# EAGLE design Data_Recovery_System (EAGLE 9.2.2)

## Sheet 1 of 4
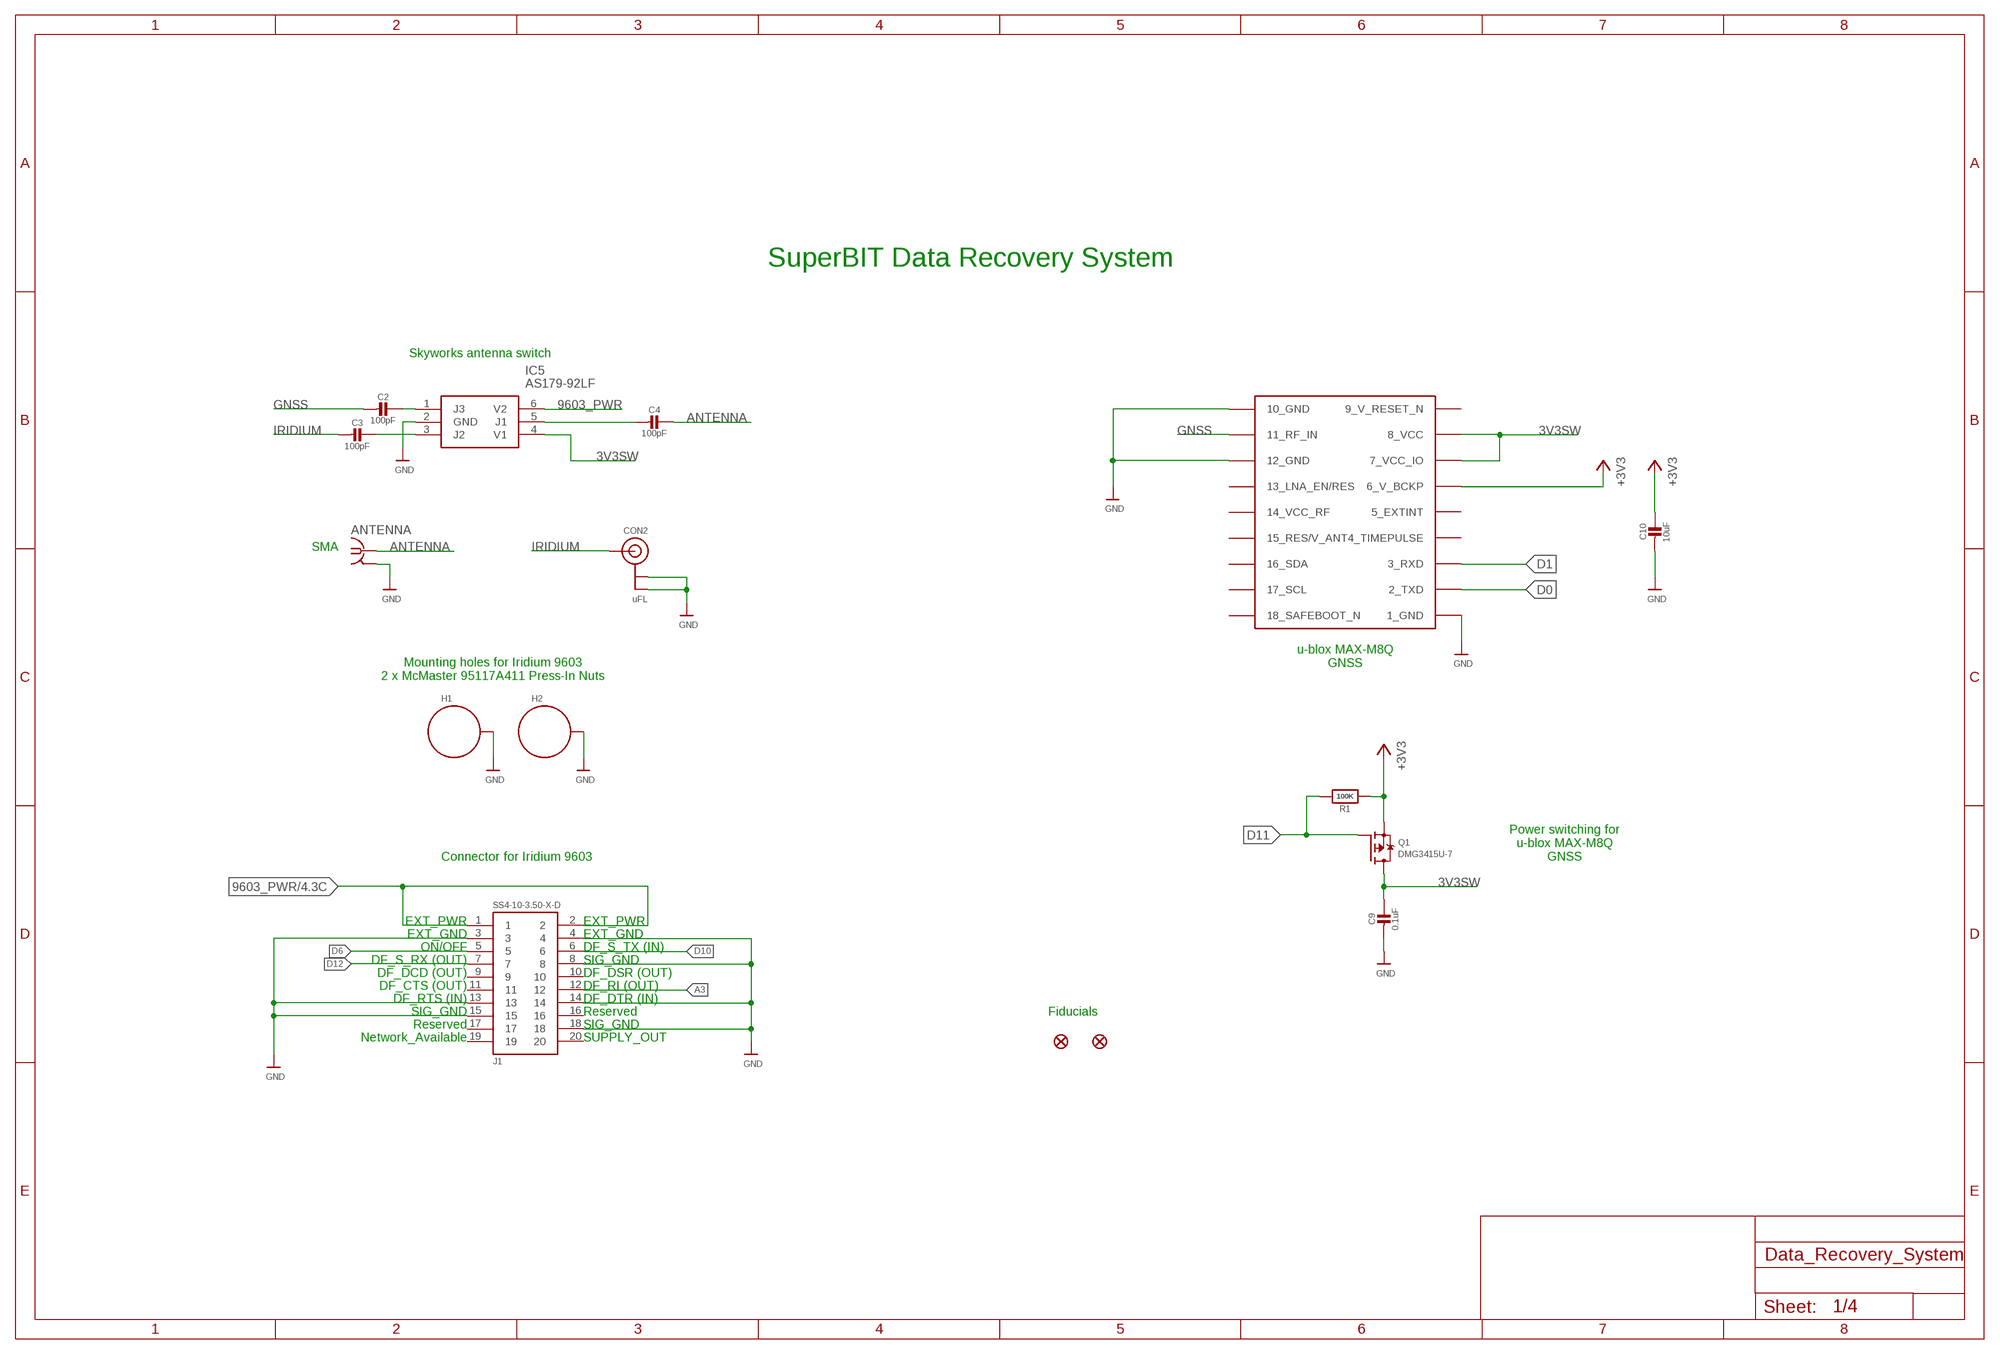
[diagram p0: schematic, sheet 1]

### Parts
ANTENNA  SMA-142-0711-821/826  [J502-ND-142-0711-821/826]
C2  100pF  CAP_CERAMIC0603_NO  [0603-NO@1]
C3  100pF  CAP_CERAMIC0603_NO  [0603-NO@1]
C4  100pF  CAP_CERAMIC0603_NO  [0603-NO@1]
C9  0.1uF  CAP_CERAMIC0805-NOOUTLINE  [0805-NO@1]
C10  10uF  CAP_CERAMIC0805-NOOUTLINE  [0805-NO@1]
CON2  uFL  ANTENNA_U.FL  [U.FL]
FD1  FIDUCIAL1X2  [FIDUCIAL-1X2]
FD2  FIDUCIAL1X2  [FIDUCIAL-1X2]
H1  STANDOFF_ELECTRICALMCMASTER-95117A411  [STANDOFF-ELECTRICAL-MCMASTER-95117A411]
H2  STANDOFF_ELECTRICALMCMASTER-95117A411  [STANDOFF-ELECTRICAL-MCMASTER-95117A411]
IC5  AS179-92LF  [SOT65P220X100-6N]
IC6  MAX-M8  [MAX-M8]
J1  SS4-10-3.50-X-D  [SS4-10-3.50-X-D]
Q1  DMG3415U-7  MOSFET-PWIDE  [SOT23-WIDE]
R1  100K  RESISTOR0805_NOOUTLINE  [0805-NO]

### Nets
3V3SW: C9.1 IC5.4(V1) IC6.7_VCC_IO IC6.8_VCC Q1.3(D)
9603_PWR: IC5.6(V2) J1.1 J1.2 ; also sheet 4
+3V3: C10.1 IC6.6_V_BCKP Q1.2(S) R1.1 ; also sheet 2,4
A3: J1.12 ; also sheet 2
ANTENNA: ANTENNA.1 C4.1
D0: IC6.2_TXD ; also sheet 2
D1: IC6.3_RXD ; also sheet 2
D6: J1.5 ; also sheet 2
D10: J1.6 ; also sheet 2
D11: Q1.1(G) R1.2 ; also sheet 2
D12: J1.7 ; also sheet 2
GND: ANTENNA.G@1 ANTENNA.G@2 ANTENNA.G@3 ANTENNA.G@4 C9.2 C10.2 CON2.1(GND) CON2.2(GND) H1.P1 H2.P1 IC5.2(GND) IC6.1_GND IC6.10_GND IC6.12_GND J1.3 J1.4 J1.8 J1.13 J1.14 J1.15 J1.18 ; also sheet 2,3,4
GNSS: C2.2 IC6.11_RF_IN
IRIDIUM: C3.2 CON2.3(SIGNAL)
N$4: C2.1 IC5.1(J3)
N$8: C3.1 IC5.3(J2)
N$9: C4.2 IC5.5(J1)
Unconnected: IC6.4_TIMEPULSE IC6.5_EXTINT IC6.13_LNA_EN(13_LNA_EN/RES) IC6.14_VCC_RF IC6.15_V_ANT/RESERVED(15_RES/V_ANT) IC6.16_SDA IC6.17_SCL IC6.18_SAFEBOOT_N J1.9 J1.10 J1.11 J1.16 J1.17 J1.19 J1.20

### Notes on the sheet
- SuperBIT Data Recovery System
- Skyworks antenna switch
- SMA
- u-blox MAX-M8Q
  GNSS
- Mounting holes for Iridium 9603
  2 x McMaster 95117A411 Press-In Nuts
- Connector for Iridium 9603
- Power switching for
  u-blox MAX-M8Q
  GNSS
- EXT_PWR | EXT_PWR
- EXT_GND | EXT_GND
- ON/OFF | DF_S_TX (IN)
- DF_S_RX (OUT) | SIG_GND
- DF_DCD (OUT) | DF_DSR (OUT)
- DF_CTS (OUT) | DF_RI (OUT)
- DF_RTS (IN) | DF_DTR (IN)
- SIG_GND | Reserved | Fiducials
- Reserved | SIG_GND
- Network_Available | SUPPLY_OUT

## Sheet 2 of 4
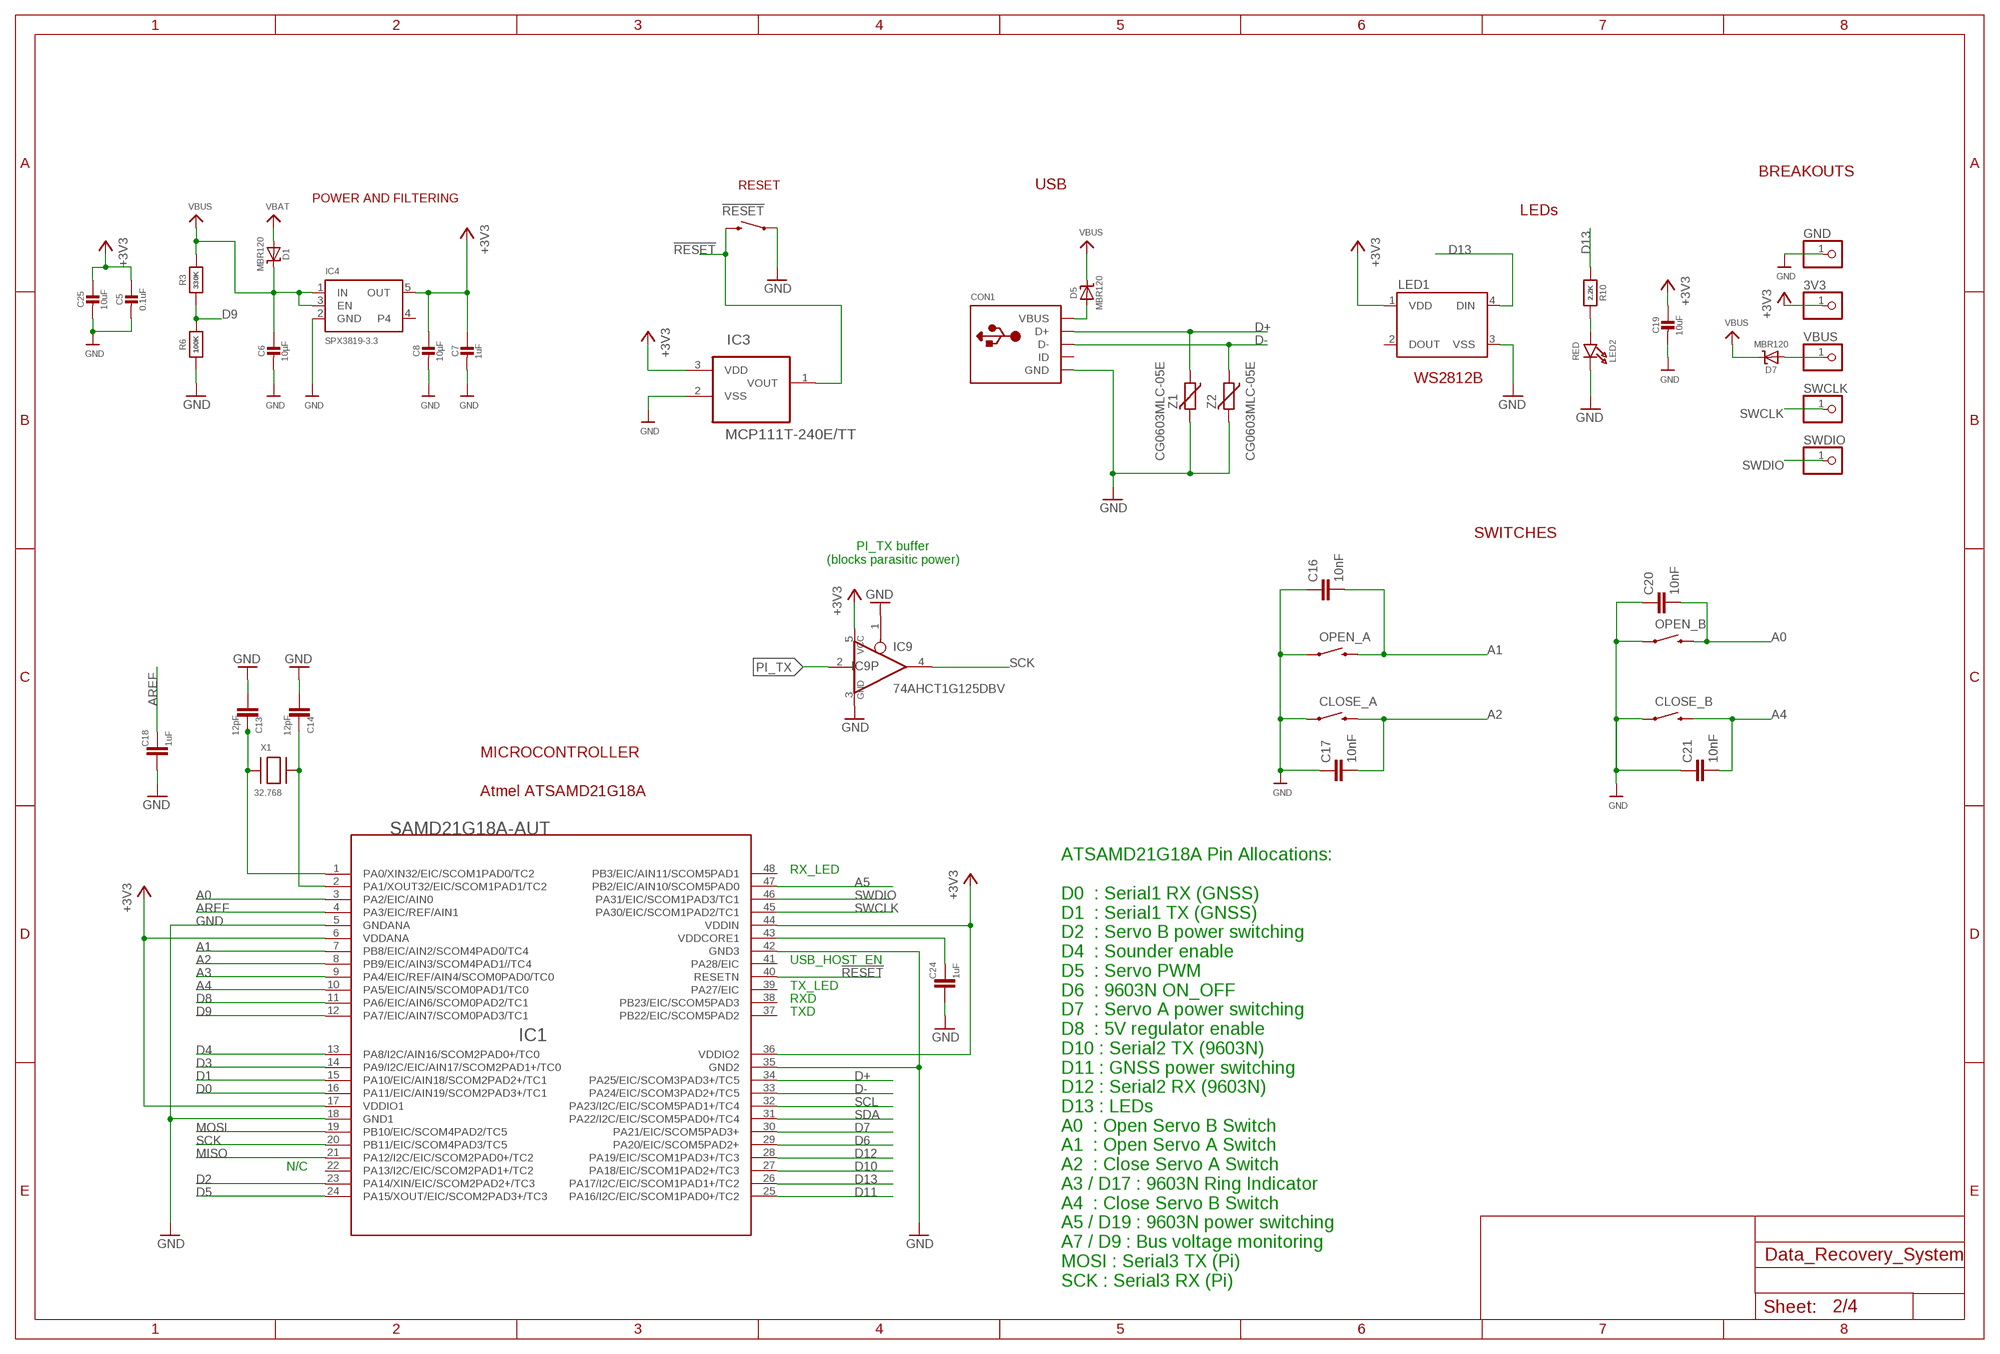
[diagram p1: schematic, sheet 2]

### Parts
3V3  PINHD-1X1  [1X01]
!RESET  SWITCH-MOMENTARY-2PTH  [TACTILE-PTH]
C5  0.1uF  CAP_CERAMIC0805-NOOUTLINE  [0805-NO@1]
C6  10µF  CAP_CERAMIC0805-NOOUTLINE  [0805-NO@1]
C7  1uF  CAP_CERAMIC0603_NO  [0603-NO@1]
C8  10µF  CAP_CERAMIC0805-NOOUTLINE  [0805-NO@1]
C13  12pF  C-EUC0603  [C0603]
C14  12pF  C-EUC0603  [C0603]
C16  10nF  C-EUC0805  [C0805]
C17  10nF  C-EUC0805  [C0805]
C18  1uF  C-EUC0603  [C0603]
C19  10uF  CAP_CERAMIC0805-NOOUTLINE  [0805-NO@1]
C20  10nF  C-EUC0805  [C0805]
C21  10nF  C-EUC0805  [C0805]
C24  1uF  C-EUC0603  [C0603]
C25  10uF  CAP_CERAMIC0805-NOOUTLINE  [0805-NO@1]
CLOSE_A  SWITCH-MOMENTARY-2PTH  [TACTILE-PTH]
CLOSE_B  SWITCH-MOMENTARY-2PTH  [TACTILE-PTH]
CON1  MICROBUILDER_USBFCI_10103594_CORRECTED  [MICROBUILDER_FCI_10103594_CORRECTED]
D1  MBR120  DIODE-SCHOTTKYSOD-123  [SOD-123]
D5  MBR120  DIODE-SCHOTTKYSOD-123  [SOD-123]
D7  MBR120  DIODE-SCHOTTKYSOD-123  [SOD-123]
GND  PINHD-1X1  [1X01]
IC1  SAMD21G18A-AUT  1792_SAMD21G18A-AUT  [TQFP48-7X7]
IC3  MCP111T-240E/TT  MCP111T-270E/TT  [SOT95P237X112-3N]
IC4  SPX3819-3.3  VREG_SOT23-5  [SOT23-5]
IC9  74AHCT1G125DBV  [SOT23-5]
LED1  WS2812B  [WS2812B]
LED2  RED  LED0805_NOOUTLINE  [CHIPLED_0805_NOOUTLINE]
OPEN_A  SWITCH-MOMENTARY-2PTH  [TACTILE-PTH]
OPEN_B  SWITCH-MOMENTARY-2PTH  [TACTILE-PTH]
R3  330K  RESISTOR0805_NOOUTLINE  [0805-NO]
R6  100K  RESISTOR0805_NOOUTLINE  [0805-NO]
R10  2.2K  RESISTOR_0603_NOOUT  [0603-NO]
SWCLK  PINHD-1X1  [1X01]
SWDIO  PINHD-1X1  [1X01]
VBUS  PINHD-1X1  [1X01]
X1  32.768  XTAL-3.2X1.5  [XTAL3215]
Z1  CG0603MLC-05E  0010_BRNCG0603MLC-05E  [CT/CN0603]
Z2  CG0603MLC-05E  0010_BRNCG0603MLC-05E  [CT/CN0603]

### Nets
!RESET: !RESET.3 IC1.40(RESETN) IC3.1(VOUT)
+3V3: 3V3.1 C5.1 C7.1 C8.1 C19.1 C25.1 IC1.6(VDDANA) IC1.17(VDDIO1) IC1.36(VDDIO2) IC1.44(VDDIN) IC3.3(VDD) IC4.5(OUT) IC9.5(VCC) LED1.1(VDD) ; also sheet 1,4
A0: C20.2 IC1.3(PA2/EIC/AIN0) OPEN_B.3
A1: C16.2 IC1.7(PB8/EIC/AIN2/SCOM4PAD0/TC4) OPEN_A.3
A2: C17.2 CLOSE_A.3 IC1.8(PB9/EIC/AIN3/SCOM4PAD1//TC4)
A3: IC1.9(PA4/EIC/REF/AIN4/SCOM0PAD0/TC0) ; also sheet 1
A4: C21.2 CLOSE_B.3 IC1.10(PA5/EIC/AIN5/SCOM0PAD1/TC0)
A5: IC1.47(PB2/EIC/AIN10/SCOM5PAD0) ; also sheet 4
AREF: C18.1 IC1.4(PA3/EIC/REF/AIN1)
D0: IC1.16(PA11/EIC/AIN19/SCOM2PAD3+/TC1) ; also sheet 1
D1: IC1.15(PA10/EIC/AIN18/SCOM2PAD2+/TC1) ; also sheet 1
D2: IC1.23(PA14/XIN/EIC/SCOM2PAD2+/TC3) ; also sheet 4
D3: IC1.14(PA9/I2C/EIC/AIN17/SCOM2PAD1+/TC0)
D4: IC1.13(PA8/I2C/AIN16/SCOM2PAD0+/TC0) ; also sheet 4
D5: IC1.24(PA15/XOUT/EIC/SCOM2PAD3+/TC3) ; also sheet 4
D6: IC1.29(PA20/EIC/SCOM5PAD2+) ; also sheet 1
D7: IC1.30(PA21/EIC/SCOM5PAD3+) ; also sheet 4
D8: IC1.11(PA6/EIC/AIN6/SCOM0PAD2/TC1) ; also sheet 4
D9: IC1.12(PA7/EIC/AIN7/SCOM0PAD3/TC1) R3.1 R6.2
D10: IC1.27(PA18/EIC/SCOM1PAD2+/TC3) ; also sheet 1
D11: IC1.25(PA16/I2C/EIC/SCOM1PAD0+/TC2) ; also sheet 1
D12: IC1.28(PA19/EIC/SCOM1PAD3+/TC3) ; also sheet 1
D13: IC1.26(PA17/I2C/EIC/SCOM1PAD1+/TC2) LED1.4(DIN) R10.1
D+: CON1.D+ IC1.34(PA25/EIC/SCOM3PAD3+/TC5) Z1.1
D-: CON1.D- IC1.33(PA24/EIC/SCOM3PAD2+/TC5) Z2.1
GND: !RESET.1 C5.2 C6.2 C7.2 C8.2 C13.2 C14.2 C16.1 C17.1 C18.2 C19.2 C20.1 C21.1 C24.2 C25.2 CLOSE_A.1 CLOSE_B.1 CON1.BASE@1(GND) CON1.BASE@2(GND) CON1.GND CON1.SPRT@1(GND) CON1.SPRT@2(GND) CON1.SPRT@3(GND) CON1.SPRT@4(GND) GND.1 IC1.5(GNDANA) IC1.18(GND1) IC1.35(GND2) IC1.42(GND3) IC3.2(VSS) IC4.2(GND) IC9.1(OE) IC9.3(GND) LED1.3(VSS) LED2.C OPEN_A.1 OPEN_B.1 R6.1 Z1.2 Z2.2 ; also sheet 1,3,4
MISO: IC1.21(PA12/I2C/EIC/SCOM2PAD0+/TC2)
MOSI: IC1.19(PB10/EIC/SCOM4PAD2/TC5) ; also sheet 3
N$1: C13.1 IC1.1(PA0/XIN32/EIC/SCOM1PAD0/TC2) X1.P$1
N$2: C14.1 IC1.2(PA1/XOUT32/EIC/SCOM1PAD1/TC2) X1.P$2
N$3: LED2.A R10.2
N$10: CON1.VBUS D5.A
N$23: D7.A VBUS.1
PI_TX: IC9.2(I) ; also sheet 3
SCK: IC1.20(PB11/EIC/SCOM4PAD3/TC5) IC9.4(O)
SCL: IC1.32(PA23/I2C/EIC/SCOM5PAD1+/TC4)
SDA: IC1.31(PA22/I2C/EIC/SCOM5PAD0+/TC4)
SWCLK: IC1.45(PA30/EIC/SCOM1PAD2/TC1) SWCLK.1
SWDIO: IC1.46(PA31/EIC/SCOM1PAD3/TC1) SWDIO.1
VBAT: D1.A ; also sheet 3,4
VBUS: C6.1 D1.C D5.C D7.C IC4.1(IN) IC4.3(EN) R3.2
VDDCORE2: C24.1 IC1.43(VDDCORE1)
Unconnected: CON1.ID IC1.22(PA13/I2C/EIC/SCOM2PAD1+/TC2) IC1.37(PB22/EIC/SCOM5PAD2) IC1.38(PB23/EIC/SCOM5PAD3) IC1.39(PA27/EIC) IC1.41(PA28/EIC) IC1.48(PB3/EIC/AIN11/SCOM5PAD1) IC4.4 LED1.2(DOUT)

### Notes on the sheet
- BREAKOUTS
- RESET | USB
- POWER AND FILTERING
- LEDs
- WS2812B
- SWITCHES
- PI_TX buffer
  (blocks parasitic power)
- MICROCONTROLLER
- Atmel ATSAMD21G18A
- ATSAMD21G18A Pin Allocations:
  
  D0  : Serial1 RX (GNSS)
  D1  : Serial1 TX (GNSS)
  D2  : Servo B power switching
  D4  : Sounder enable
  D5  : Servo PWM
  D6  : 9603N ON_OFF
  D7  : Servo A power switching
  D8  : 5V regulator enable
  D10 : Serial2 TX (9603N)
  D11 : GNSS power switching
  D12 : Serial2 RX (9603N)
  D13 : LEDs
  A0  : Open Servo B Switch
  A1  : Open Servo A Switch
  A2  : Close Servo A Switch
  A3 / D17 : 9603N Ring Indicator
  A4  : Close Servo B Switch
  A5 / D19 : 9603N power switching
  A7 / D9 : Bus voltage monitoring
  MOSI : Serial3 TX (Pi)
  SCK : Serial3 RX (Pi)
- RX_LED
- USB_HOST_EN
- TX_LED
- RXD
- TXD
- N/C

## Sheet 3 of 4
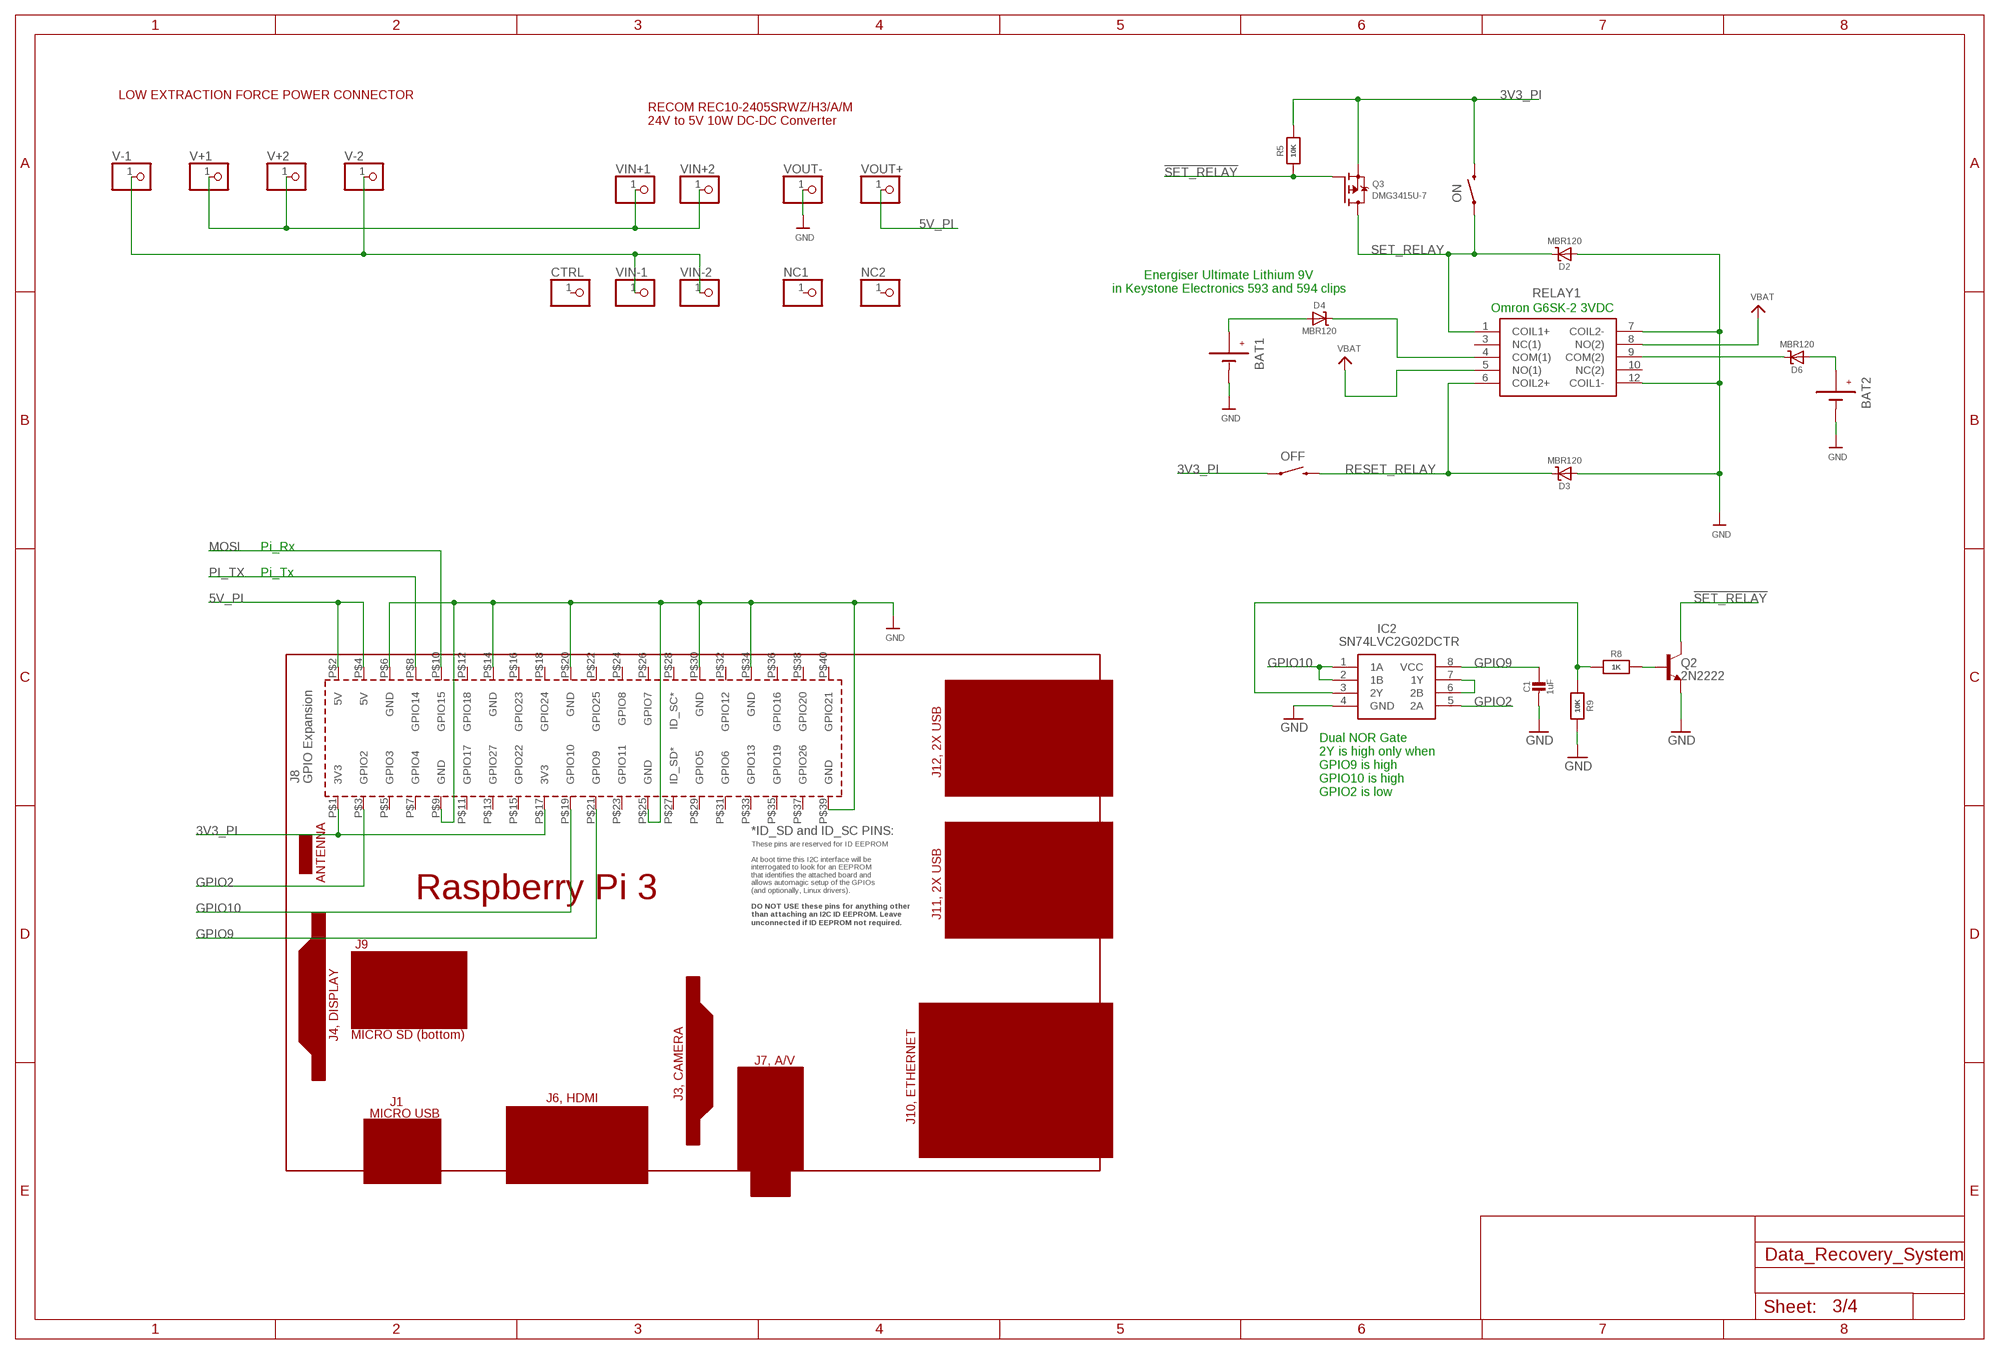
[diagram p2: schematic, sheet 3]

### Parts
BAT1  BATTERYBATTERY-9V-KEYSTONE-593-594  [BATTERY-9V-KEYSTONE-593-594]
BAT2  BATTERYBATTERY-9V-KEYSTONE-593-594  [BATTERY-9V-KEYSTONE-593-594]
C1  1uF  CAP_CERAMIC0603_NO  [0603-NO@1]
CTRL  PINHD-1X1  [1X01]
D2  MBR120  DIODE-SCHOTTKYSOD-123  [SOD-123]
D3  MBR120  DIODE-SCHOTTKYSOD-123  [SOD-123]
D4  MBR120  DIODE-SCHOTTKYSOD-123  [SOD-123]
D6  MBR120  DIODE-SCHOTTKYSOD-123  [SOD-123]
IC2  SN74LVC2G02DCTR  [SOP65P400X130-8N]
NC1  PINHD-1X1  [1X01]
NC2  PINHD-1X1  [1X01]
OFF  SWITCH-MOMENTARY-2PTH  [TACTILE-PTH]
ON  SWITCH-MOMENTARY-2PTH  [TACTILE-PTH]
PCB1  RPI3  [RPI3]
Q2  2N2222  MMBT2222ALT1-NPN-SOT23-BEC  [SOT23-BEC]
Q3  DMG3415U-7  MOSFET-PWIDE  [SOT23-WIDE]
R5  10K  RESISTOR0805_NOOUTLINE  [0805-NO]
R8  1K  RESISTOR_0603_NOOUT  [0603-NO]
R9  10K  RESISTOR_0603_NOOUT  [0603-NO]
RELAY1  G6SK-2_DC5  [G6SK2DC5]
V+1  PINHD-1X1  [1X01]
V+2  PINHD-1X1  [1X01]
V-1  PINHD-1X1  [1X01]
V-2  PINHD-1X1  [1X01]
VIN+1  PINHD-1X1  [1X01]
VIN+2  PINHD-1X1  [1X01]
VIN-1  PINHD-1X1  [1X01]
VIN-2  PINHD-1X1  [1X01]
VOUT+  PINHD-1X1  [1X01]
VOUT-  PINHD-1X1  [1X01]

### Nets
3V3_PI: OFF.1 ON.3 PCB1.P$1(3V3) PCB1.P$17(3V3) Q3.2(S) R5.2
5V_PI: PCB1.P$2(5V) PCB1.P$4(5V) VOUT+.1
!SET_RELAY: Q2.C Q3.1(G) R5.1
GND: BAT1.GND1(-) BAT1.GND2(-) BAT1.GND(-) BAT2.GND1(-) BAT2.GND2(-) BAT2.GND(-) C1.2 D2.A D3.A IC2.4(GND) PCB1.P$6(GND) PCB1.P$9(GND) PCB1.P$14(GND) PCB1.P$20(GND) PCB1.P$25(GND) PCB1.P$30(GND) PCB1.P$34(GND) PCB1.P$39(GND) Q2.E R9.2 RELAY1.7(COIL2-) RELAY1.12(COIL1-) VOUT-.1 ; also sheet 1,2,4
GPIO2: IC2.5(2A) PCB1.P$3(GPIO2)
GPIO9: C1.1 IC2.8(VCC) PCB1.P$21(GPIO9)
GPIO10: IC2.1(1A) IC2.2(1B) PCB1.P$19(GPIO10)
MOSI: PCB1.P$10(GPIO15) ; also sheet 2
N$5: V-1.1 V-2.1 VIN-1.1 VIN-2.1
N$7: D6.C RELAY1.9(COM(2))
N$11: BAT2.PWR1(+) BAT2.PWR2(+) BAT2.PWR(+) D6.A
N$12: BAT1.PWR1(+) BAT1.PWR2(+) BAT1.PWR(+) D4.A
N$13: D4.C RELAY1.4(COM(1))
N$14: Q2.B R8.2
N$16: IC2.3(2Y) R8.1 R9.1
N$21: IC2.6(2B) IC2.7(1Y)
PI_TX: PCB1.P$8(GPIO14) ; also sheet 2
RESET_RELAY: D3.C OFF.3 RELAY1.6(COIL2+)
SET_RELAY: D2.C ON.1 Q3.3(D) RELAY1.1(COIL1+)
V_EXT: V+1.1 V+2.1 VIN+1.1 VIN+2.1
VBAT: RELAY1.5(NO(1)) RELAY1.8(NO(2)) ; also sheet 2,4
Unconnected: CTRL.1 NC1.1 NC2.1 PCB1.P$5(GPIO3) PCB1.P$7(GPIO4) PCB1.P$11(GPIO17) PCB1.P$12(GPIO18) PCB1.P$13(GPIO27) PCB1.P$15(GPIO22) PCB1.P$16(GPIO23) PCB1.P$18(GPIO24) PCB1.P$22(GPIO25) PCB1.P$23(GPIO11) PCB1.P$24(GPIO8) PCB1.P$26(GPIO7) PCB1.P$27(ID_SD*) PCB1.P$28(ID_SC*) PCB1.P$29(GPIO5) PCB1.P$31(GPIO6) PCB1.P$32(GPIO12) PCB1.P$33(GPIO13) PCB1.P$35(GPIO19) PCB1.P$36(GPIO16) PCB1.P$37(GPIO26) PCB1.P$38(GPIO20) PCB1.P$40(GPIO21) RELAY1.3(NC(1)) RELAY1.10(NC(2))

### Notes on the sheet
- LOW EXTRACTION FORCE POWER CONNECTOR
- RECOM REC10-2405SRWZ/H3/A/M
  24V to 5V 10W DC-DC Converter
- Energiser Ultimate Lithium 9V
  in Keystone Electronics 593 and 594 clips
- Omron G6SK-2 3VDC
- Pi_Rx
- Pi_Tx
- Dual NOR Gate
  2Y is high only when
  GPIO9 is high
  GPIO10 is high
  GPIO2 is low

## Sheet 4 of 4
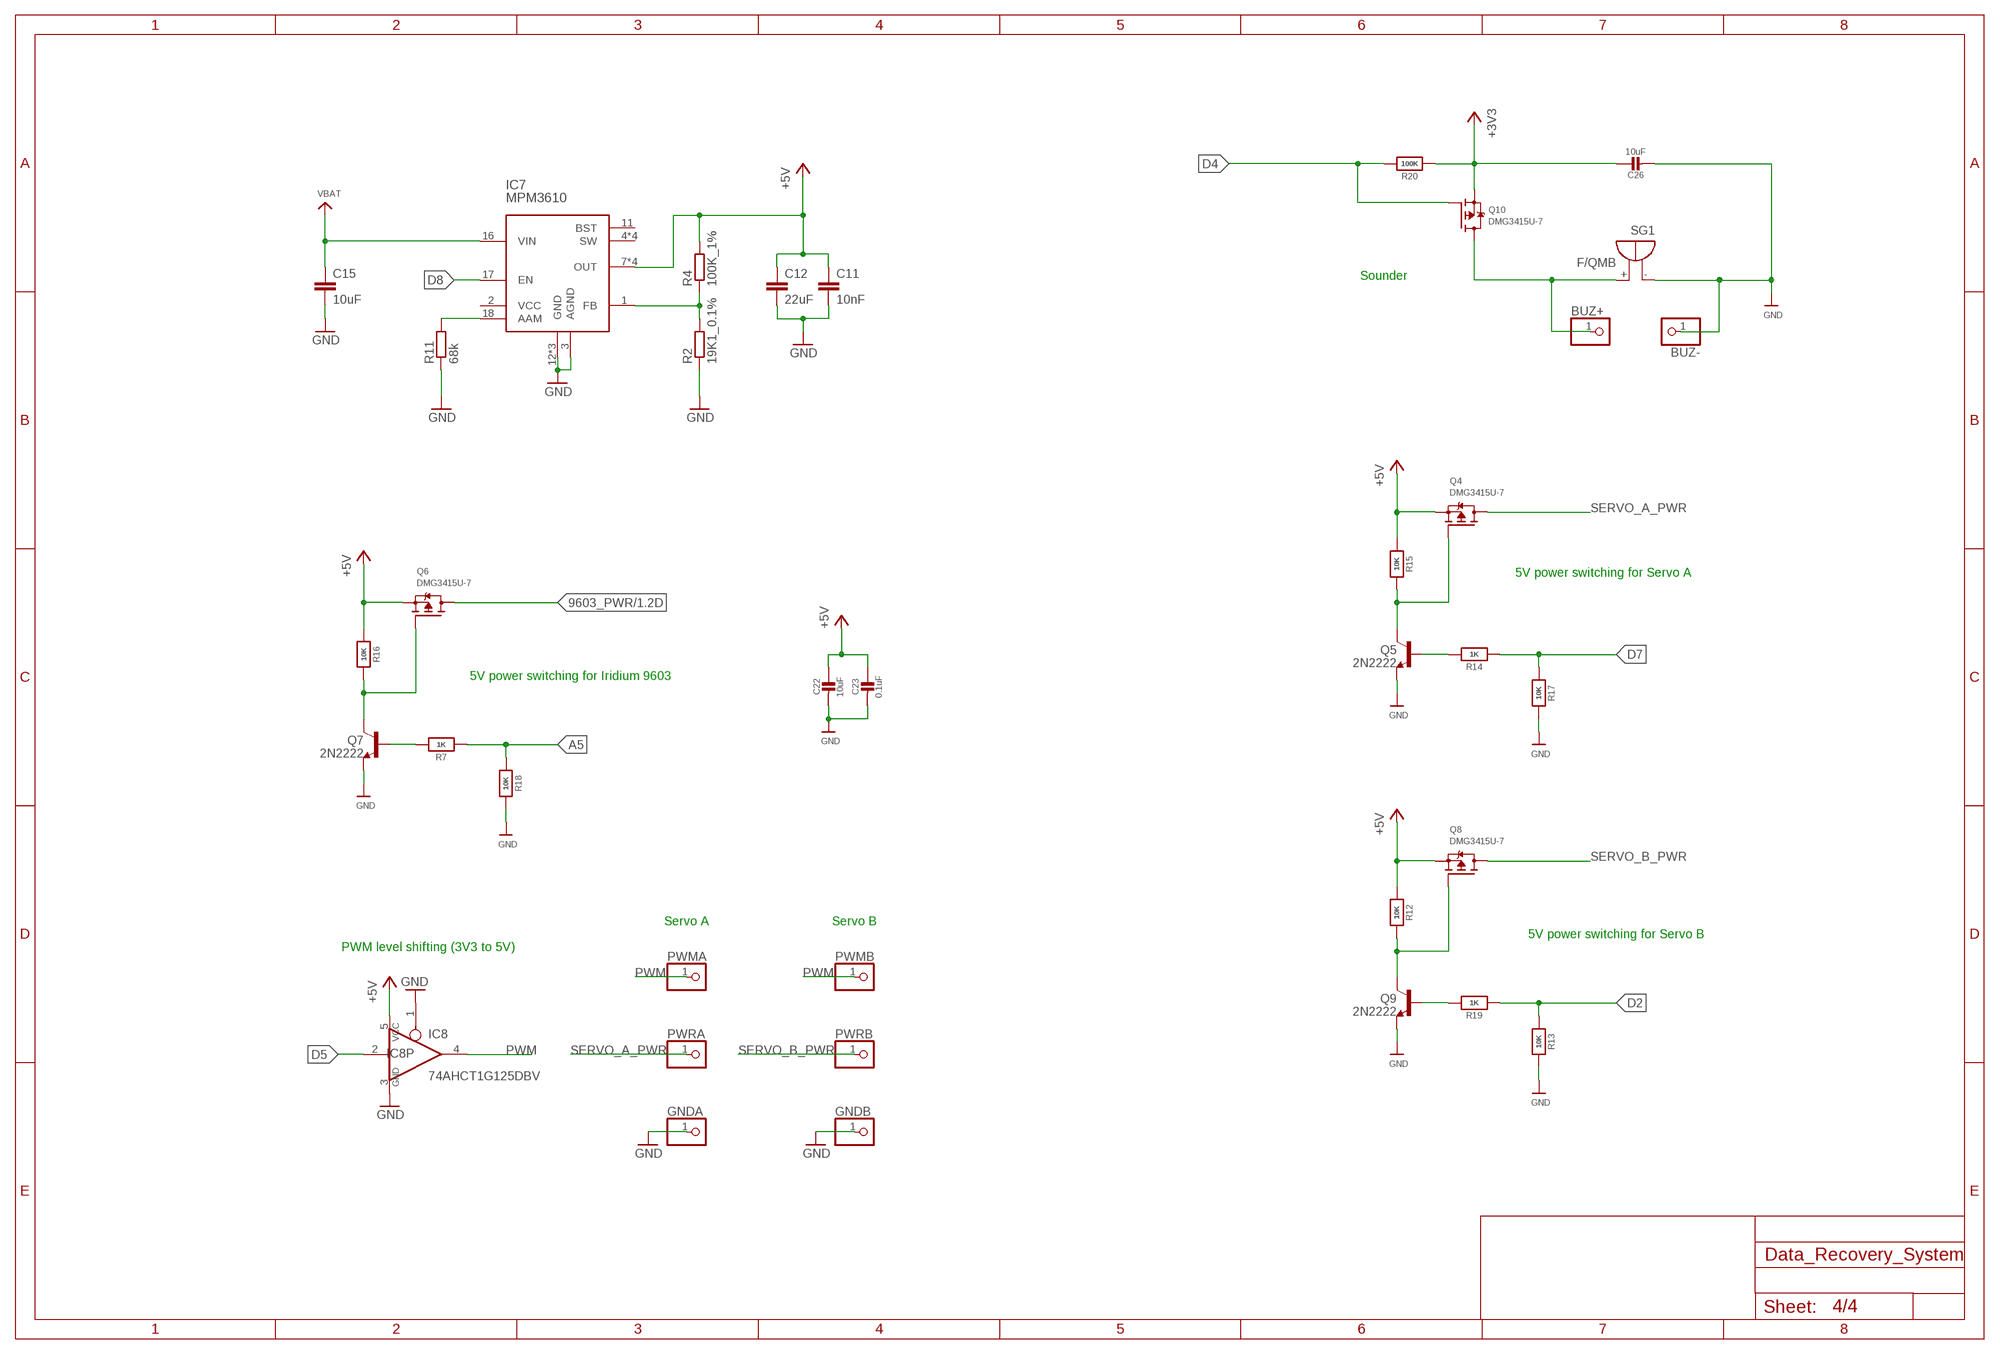
[diagram p3: schematic, sheet 4]

### Parts
BUZ+  PINHD-1X1  [1X01]
BUZ-  PINHD-1X1  [1X01]
C11  10nF  C-EUC0805  [C0805]
C12  22uF  C-EUC0805  [C0805]
C15  10uF  C-EUC0805  [C0805]
C22  10uF  CAP_CERAMIC0805-NOOUTLINE  [0805-NO@1]
C23  0.1uF  CAP_CERAMIC0805-NOOUTLINE  [0805-NO@1]
C26  10uF  CAP_CERAMIC0805-NOOUTLINE  [0805-NO@1]
GNDA  PINHD-1X1  [1X01]
GNDB  PINHD-1X1  [1X01]
IC7  MPM3610  2093_MPM3610GQV-P  [QFN-20]
IC8  74AHCT1G125DBV  [SOT23-5]
PWMA  PINHD-1X1  [1X01]
PWMB  PINHD-1X1  [1X01]
PWRA  PINHD-1X1  [1X01]
PWRB  PINHD-1X1  [1X01]
Q4  DMG3415U-7  MOSFET-PWIDE  [SOT23-WIDE]
Q5  2N2222  MMBT2222ALT1-NPN-SOT23-BEC  [SOT23-BEC]
Q6  DMG3415U-7  MOSFET-PWIDE  [SOT23-WIDE]
Q7  2N2222  MMBT2222ALT1-NPN-SOT23-BEC  [SOT23-BEC]
Q8  DMG3415U-7  MOSFET-PWIDE  [SOT23-WIDE]
Q9  2N2222  MMBT2222ALT1-NPN-SOT23-BEC  [SOT23-BEC]
Q10  DMG3415U-7  MOSFET-PWIDE  [SOT23-WIDE]
R2  19K1_0.1%  R-EU_R0805  [R0805]
R4  100K_1%  R-EU_R0805  [R0805]
R7  1K  RESISTOR_0603_NOOUT  [0603-NO]
R11  68k  R-EU_R0805  [R0805]
R12  10K  RESISTOR_0603_NOOUT  [0603-NO]
R13  10K  RESISTOR_0603_NOOUT  [0603-NO]
R14  1K  RESISTOR_0603_NOOUT  [0603-NO]
R15  10K  RESISTOR_0603_NOOUT  [0603-NO]
R16  10K  RESISTOR_0603_NOOUT  [0603-NO]
R17  10K  RESISTOR_0603_NOOUT  [0603-NO]
R18  10K  RESISTOR_0603_NOOUT  [0603-NO]
R19  1K  RESISTOR_0603_NOOUT  [0603-NO]
R20  100K  RESISTOR0805_NOOUTLINE  [0805-NO]
SG1  F/QMB  [F/QMB]

### Nets
9603_PWR: Q6.3(D) ; also sheet 1
+3V3: C26.1 Q10.2(S) R20.1 ; also sheet 1,2
+5V: C11.1 C12.1 C22.1 C23.1 IC7.7(OUT) IC7.8(OUT) IC7.9(OUT) IC7.20(OUT) IC8.5(VCC) Q4.2(S) Q6.2(S) Q8.2(S) R4.2 R12.1 R15.1 R16.1
A5: R7.1 R18.1 ; also sheet 2
D2: R13.1 R19.1 ; also sheet 2
D4: Q10.1(G) R20.2 ; also sheet 2
D5: IC8.2(I) ; also sheet 2
D7: R14.1 R17.1 ; also sheet 2
D8: IC7.17(EN) ; also sheet 2
GND: BUZ-.1 C11.2 C12.2 C15.2 C22.2 C23.2 C26.2 GNDA.1 GNDB.1 IC7.3(AGND) IC7.12(GND) IC7.13(GND) IC7.14(GND) IC8.1(OE) IC8.3(GND) Q5.E Q7.E Q9.E R2.1 R11.1 R13.2 R17.2 R18.2 SG1.-(+) ; also sheet 1,2,3
N$6: IC7.1(FB) R2.2 R4.1
N$15: Q7.B R7.2
N$17: Q6.1(G) Q7.C R16.2
N$18: Q9.B R19.2
N$19: Q4.1(G) Q5.C R15.2
N$20: Q5.B R14.2
N$22: Q8.1(G) Q9.C R12.2
N$24: BUZ+.1 Q10.3(D) SG1.+(-)
N$29: IC7.18(AAM) R11.2
PWM: IC8.4(O) PWMA.1 PWMB.1
SERVO_A_PWR: PWRA.1 Q4.3(D)
SERVO_B_PWR: PWRB.1 Q8.3(D)
VBAT: C15.1 IC7.16(VIN) ; also sheet 2,3
Unconnected: IC7.2(VCC) IC7.4(SW) IC7.5(SW) IC7.6(SW) IC7.11(BST) IC7.19(SW)

### Notes on the sheet
- Sounder
- 5V power switching for Servo A
- 5V power switching for Iridium 9603
- Servo A | Servo B
- 5V power switching for Servo B
- PWM level shifting (3V3 to 5V)

## Power pins joined to a net without a drawn wire
9_V_RESET_N: IC6.9_RESET_N(9_V_RESET_N)

## Library data of the parts
3V3 BUZ+ BUZ- CTRL GND GNDA GNDB NC1 NC2 PWMA PWMB PWRA PWRB SWCLK SWDIO V+1 V+2 V-1 V-2 VBUS VIN+1 VIN+2 VIN-1 VIN-2 VOUT+ VOUT- = adafruit:PINHD-1X1: Pin header 1x1 for 0.1" spacing With round pins
!RESET CLOSE_A CLOSE_B OFF ON OPEN_A OPEN_B = SparkFun-Electromechanical:SWITCH-MOMENTARY-2: Various NO switches- pushbuttons, reed, etc; PROD_ID: SWCH-08441
ANTENNA = con-coax:SMA-: SMA 50 Ohm End Launch Jack Receptacle - Round Contact Johnson Components Source: www.johnsoncomponents.com .. J502-ND.pdf; MF: JOHNSON COMPONENTS; MPN: 142-0711-821; OC_FARNELL: 1019328; OC_NEWARK: 16F3627
BAT1 BAT2 = SparkFun-Electromechanical:BATTERY: Battery Holders Various common sizes : AA, AAA, 18650 (PRT-12895), 20mm coin cell and 12mm coin cell. 20MM_4LEGS, BATT-10373
C1-C10 C19 C22 C23 C25 C26 = microbuilder:CAP_CERAMIC: Ceramic Capacitors For new designs, use the packages preceded by an '_' character since they are more reliable: The following footprints should be used on most boards: _0402 - Standard footprint for regular board layouts _0603 - Standard footprint for regular board layouts _0805 - Standard footprint for regular board layouts _1206 - Standard footprint for regular board layouts For extremely tight-pitch boards where space is at a premium, the following 'micro-pitch' footprints can be used (smaller pads, no silkscreen outline, etc.): _0402MP - Micro-pitch footprint for very dense/compact boards _0603MP - Micro-pitch footprint for very dense/compact boards _0805MP - Micro-pitch footprint for very dense/compact boards _1206MP - Micro-pitch footprint for very dense/compact boards
C11-C18 C20 C21 C24 = rcl:C-EU: CAPACITOR, European symbol; SPICEPREFIX: C
CON1 = Iridium_9603_Beacon:MICROBUILDER_USB: USB Connectors USBMINIB - Surface Mount Female Mini-B USB Connector 4UConnector: 06564
CON2 = microbuilder:ANTENNA_U.FL: U.FL Antenna Connector
D1-D7 = microbuilder:DIODE-SCHOTTKY
FD1 FD2 = SparkFun-Aesthetics:FIDUCIAL: Fiducial Alignment Points Various fiducial points for machine vision alignment.
H1 H2 = SparkFun-Electromechanical:STANDOFF_ELECTRICAL: A standoff intended to be an electrically connected point.
IC1 = IntegratedCircuits:1792_SAMD21G18A-AUT: Atmel D21 32bit ARM Cortex-M0 microcontroller - 48 PIN TQFP 256KB flash memory + 32KB SRAM
IC2 = SamacSys_Parts:SN74LVC2G02DCTR: DUAL 2-INPUT POSITIVE-NOR GATE Source: Datasheet <http://www.ti.com/lit/gpn/sn74lvc2g02>; ARROW_PART_NUMBER: SN74LVC2G02DCTR; ARROW_PRICE/STOCK: https://www.arrow.com/en/products/sn74lvc2g02dctr/texas-instruments; DESCRIPTION: DUAL 2-INPUT POSITIVE-NOR GATE; HEIGHT: mm; MANUFACTURER_NAME: Texas Instruments; MANUFACTURER_PART_NUMBER: SN74LVC2G02DCTR
IC3 = Microchip-MCP11:MCP11: Micropower Voltage Detector ,SOT23-3;; MPN: MCP111T-240E/TT; OC_FARNELL: 1851877; OC_NEWARK: 56J7328; PACKAGE: SOT23-3; SUPPLIER: MICROCHIP
IC4 = microbuilder:VREG_SOT23-5: SOT23-5 Fixed Voltage Regulators Part Current Out V Out V In V Dropout ?JA (°C/W) TJ (°C) Digikey Part No. ADP121 150mA 3.3V 3.4-5.5V 0.09V @ 150mA -- -- ADP121-AUJZ33R7CT-ND ADP121 150mA 3.0V 3.1-5.5V 0.09V @ 150mA -- -- ADP121-AUJZ30R7CT-ND ADP122 300mA 3.3V 3.4-5.5V 0.085V @ 300mA -- -- ADP122AUJZ-3.3-R7CT-ND ADP1712 300mA 3.3V 3.5-5.5V 0.17V @ 300mA -- -- ADP1712AUJZ-3.3-R7TR-ND AP7311 (Low Cost) 150mA 3.3V 3.5-6V 0.15V @ 150mA -- -- AP7311-33WG-7DICT-ND LD39015M18R 150mA 1.8V 1.9V-5.5V 0.08V @ 100mA -- -- 497-6977-1-ND LP2985A-33DBVR 150mA 3.3V 3.3-16V 0.28V @ 150mA 206 150 296-18479-1-ND MCP1824T-3302E/OT 300mA 3.3V 3.5V-6V 0.2V @ 300mA -- -- MCP1824T-3302E/OTCT-ND MIC5205-2.5YM5 TR 150mA 2.5V 2.7-16V 0.165V @ 150mA -- -- 576-1257-2-ND MIC5205-3.0YM5 TR 150mA 3.0V 3.2V-16V 0.165V @ 150mA -- -- 576-1258-2-ND MIC5205-3.3YM5 TR 150mA 3.3V 3.5V-16V 0.165V @ 150mA -- -- 576-1259-2-ND TPS780330220 150mA 3.3V+2.2V 3.6-5.5V 250mV Max -- -- 296-23332-1-ND TDA3663/N1,135 100mA 3.3V 3.5-45V 0.18V @ 50mA -- -- 568-5343-1-ND Max operating temp can be calculated using ?JA, TJ (max junction temperature), and power in watts. Set the "Maximum Ambient Temperature" until it reaches TJ ("Max Junction Temperature"), which is the absolute limit for safe use of the regulator: Heat Sink Temperature Calculator <http://www.daycounter.com/Calculators/Heat-Sink-Temperature-Calculator.phtml> For example, With 12V source into a 3.3V LP2985 and a 30mA load, we are dissipating (12V-3.3V) * 0.03A = 0.261W. With a ?JA of 206 °C/W, a TJ of 150°C, and 261mW we can safely use the chip without a heat sink up to 75°C (=147.1°C Junction Temperature).
IC5 = SamacSys_Parts:AS179-92LF: SKYWORKS SOLUTIONS - AS179-92LF - IC, SWITCH, RF, SPDT, 0.02-3.0GHZ Source: Datasheet <http://www.skyworksinc.com/uploads/documents/AS179_92LF_200176H.pdf>; ARROW_PART_NUMBER: AS179-92LF; DESCRIPTION: SKYWORKS SOLUTIONS - AS179-92LF - IC, SWITCH, RF, SPDT, 0.02-3.0GHZ; HEIGHT: 1mm; MANUFACTURER_NAME: Skyworks; MANUFACTURER_PART_NUMBER: AS179-92LF
IC6 = ubloxLib:MAX-M8: u-blox MAX GNSS module
IC7 = IntegratedCircuits:2093_MPM3610GQV-P: MPM3610 Step Down Regulator; CASE: QFN-20; PART_NUMBER: MPM3610GQV-P; TYPE: Circuito_Integrato
IC8 IC9 = 74xx-little-us:74*1G125: Single Bus Buffer Gate with 3-State Output
J1 = SS4-10-3.50-X-D:SS4-10-3.50-X-D: 0.4mm[.016] SOCKET STRIP ASSEMBLY.
LED1 = SparkFun-LED:WS2812B: WS2812B - Intelligent control LED integrated light source Technical Specifications: Power Supply Voltage (VDD): 3.5 to 5.3 V Input Voltage (VI): -0.5 to VDD+0.5 V Operating Junction Temperature (Topt): -25°C to +80°C Storage Temperature Range (Tstg): -55°C to +150°C; PROD_ID: DIO-12503
LED2 = microbuilder:LED: LED 0603 - 0603 Surface Mount Package 2mA: Green LED - Low Power (3.9mcd, 2ma, 1.7Vf) - Digikey: 475-2709-2-ND Orange LED - Low Power (9.8mcd, 2ma, 1.8Vf) - Digikey: 475-1194-2-ND Red LED - Low Power (5mcd, 2ma, 1.8Vf) - Digikey: 475-1195-2-ND Yellow LED - Low Power (7mcd, 2ma, 1.8Vf) - Digikey: 475-1196-2-ND 5mA: Blue LED - Low Power (17mcd, 5ma, 2.9Vf) - Digikey: LNJ937W8CRACT-ND 0805 - 0805 Surface Mount Package 2mA: Red LED (8.8mcd, 2mA, 1.8Vf, Clear) - Low Power [Digikey: 475-2510-1-ND] Green LED (5mcd, 2mA, 1.8Vf, Clear) - Low Power [Digikey: 475-2730-1-ND] Yellow LED (11.3mcd, 2mA, 1.8Vf, Clear) - Low Power [Digikey: 475-2555-1-ND] 20mA: Red LED (104mcd, 20mA, Diffused) - LS R976 [Digikey: 475-1278-6-ND] Red LED (12mcd, 20mA, 2.0Vf, Clear) - APT2012EC [Digikey: 754-1128-1-ND] Green LED (15mcd, 20mA, 2.2Vf, Clear) - APT2012GC [Digikey: 754-1131-1-ND] Orange LED (160mcd, 20mA, 2.1Vf, Clear) - APT2012SECK [Digikey: 754-1130-1-ND] 1206 - 1206 Surface Mount Package Green LED (26mcd, 20mA, Diffused) - LG N971 [Digikey: 475-1407-6-ND] Red LED (15mcd, 20mA, Diffused) - LH N974 [Digikey: 475-1416-6-ND] Cree - Cree High-Power Surface Mount LEDs XPEBWT-L1-0000-00D50 - White 111lm 350mA 2.9Vf 6200K 110° XTEAWT-00-0000-00000LEE3 - White 114lm 350mA 2.85Vf 5000K 115° Everlight - Everlight 45-21 Series Surface Mount LEDs 45-21/QK2C-B2832AC2CB2/2T - Warm White 2000mcd 20mA 3.25Vf 3050K 120° 45-21/LK2C-B38452C4CB2/2T - Nuetral White 2000mcd 20mA 3.25Vf 4150K 120° 45-21/LK2C-B50634C6CB2/2T - Cold White 2200mcd 20mA 3.25Vf 5650K 120° PLCC2 Reverse Mount LS T77K-J1L2-1-0-2-R18-Z - Red 11.25mcd 2mA 1.8Vf 630nm 120° LO T77K-L1M2-24-Z - Orange 19.6mcd 2mA 1.8Vf 606nm 120° LY T77K-K2M1-26-Z - Yellow 15.7mcd 2mA 1.8Vf 587nm 120°
PCB1 = e14_Rpi3_RevA:RPI3: Device for Raspberry Pi 3 board created by Dave Young for www.element14.com More information and support community is available at https://www.element14.com/community/community/raspberry-pi
Q1 Q3 Q4 Q6 Q8 Q10 = microbuilder:MOSFET-P: P-Channel Mosfet LEGEND VDS: Voltage Drain-Source ID: Drain Current RDS(ON): Drain-Source On-State Resistance VGS(TH): Gate-Source Threshold Voltage CISS: Drain-Source Input Capacitance SOT-23 Name VDS ID RDS(ON) VGS(TH) CISS Order Number IRLML5103 30V 760mA 600 mOhm -- 75pF @ 25V Digikey: IRLML5103PBFCT-ND IRLML6401 12V 4.3A 50 mOhm 950mV @ 250µA 830pF @ 10V Digikey: IRLML6401PBFTR-ND NTR0202PL 20V 400mA 800 mOhm 2.3V @ 250uA 70pF @ 5V Digikey: NTR0202PLT1GOSTR-ND NTR4101PT1G 20V 1.8A 85 mOhm 1.2V @ 250uA 675pF @ 10V Digikey: NTR4101PT1GOSCT-ND DMP2004K 20V 600mA 900 mOhm 1V @ 250uA 175pF @ 16V Digikey: DMP2004KDICT-ND PMV65XP 20V 3.9A 76 mOhm 950mV @ 1mA 725pF @ 20V Digikey: 568-2358-2-ND TO-252 Name VDS ID RDS(ON) VGS(TH) CISS Order Number AOD417 30V 25A 34 mOhm 3V @ 250µA 920pF @ 15V Digikey: 785-1106-2-ND
Q2 Q5 Q7 Q9 = transistor:*-NPN-: NPN Transistror BF959 corrected 2008.03.06
R1 R3 R5-R10 R12-R20 = microbuilder:RESISTOR: Resistors For new designs, use the packages preceded by an '_' character since they are more reliable: The following footprints should be used on most boards: _0402 - Standard footprint for regular board layouts _0603 - Standard footprint for regular board layouts _0805 - Standard footprint for regular board layouts _1206 - Standard footprint for regular board layouts For extremely tight-pitch boards where space is at a premium, the following 'micro-pitch' footprints can be used (smaller pads, no silkscreen outline, etc.): _0402MP - Micro-pitch footprint for very dense/compact boards _0603MP - Micro-pitch footprint for very dense/compact boards _0805MP - Micro-pitch footprint for very dense/compact boards _1206MP - Micro-pitch footprint for very dense/compact boards
R2 R4 R11 = rcl:R-EU_: RESISTOR, European symbol; SPICEPREFIX: R
RELAY1 = G6SK-2_DC5:G6SK-2_DC5: RELAY TELECOM DPDT 2A 5V Source: Datasheet <http://omronfs.omron.com/en_US/ecb/products/pdf/en-g6s.pdf>; DESCRIPTION: RELAY TELECOM DPDT 2A 5V; HEIGHT: 9mm; MANUFACTURER_NAME: Omron Electronics; MANUFACTURER_PART_NUMBER: G6SK-2 DC5
SG1 = buzzer:F/QMB: BUZZER Source: Buerklin; OC_FARNELL: unknown; OC_NEWARK: unknown
X1 = adafruit2:XTAL: Low cost SMT crystals, no capacitors included http://www.ladyada.net/library/eagle
Z1 Z2 = Protezione:0010_BRNCG0603MLC-05E: CG0603MLC-05E; MONTHLY_USAGE: _____; PART_NUMBER: BRNCG0603MLC-05E; PRICE: _____; SUPPLIER: _____; TYPE: Protezione; VALUE: BRNCG0603MLC-05E

## Net classes
2 gnd: width 0.102 mm, drill 0.1 mm
4 USBpair: width 0.102 mm, drill 0.1 mm, clearance 0.15 mm to class 3

## Board
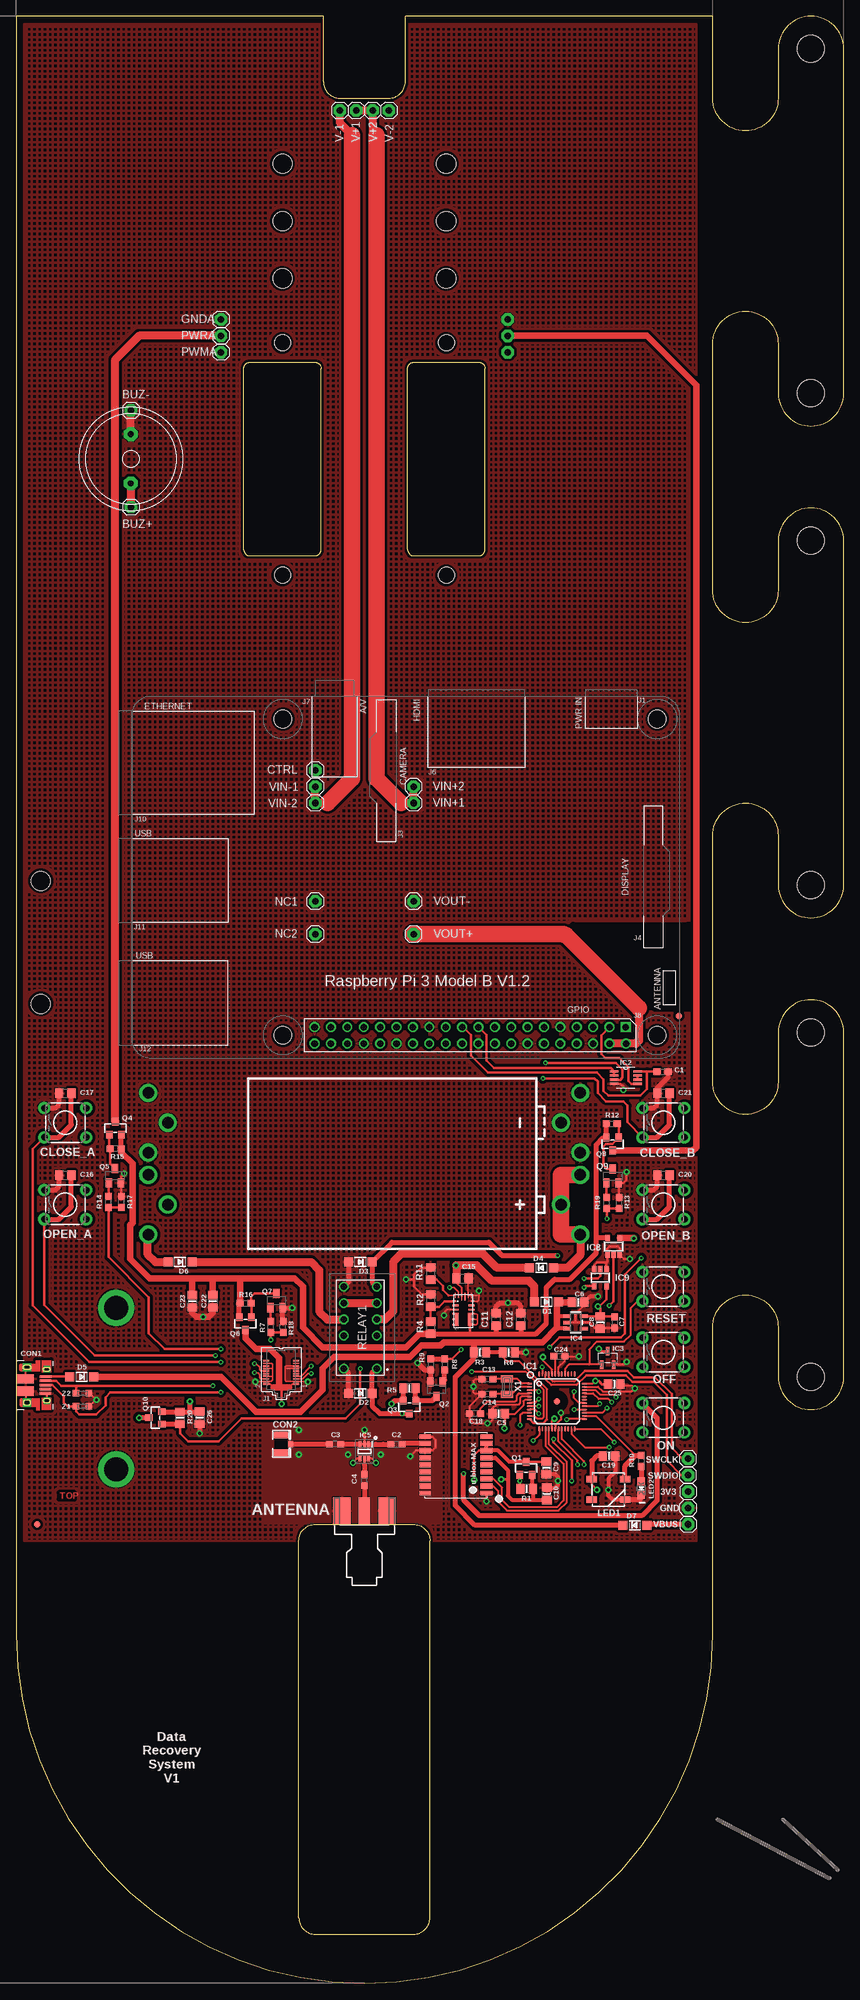
[diagram p4: board, top side]
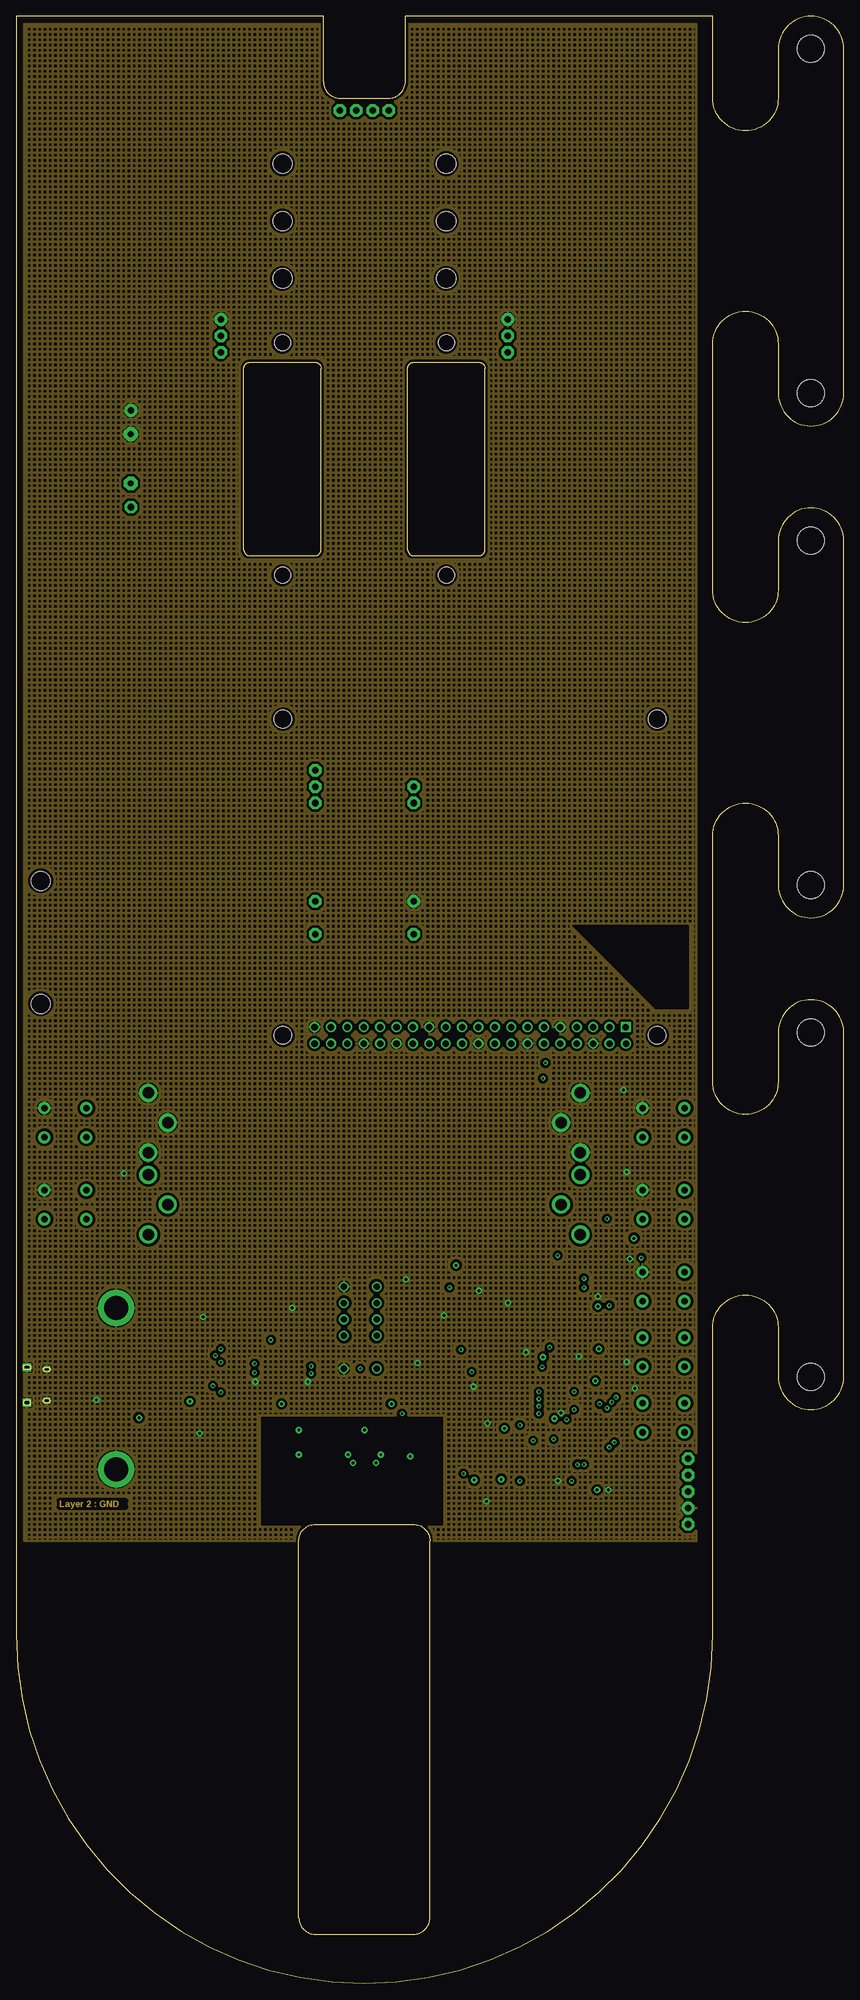
[diagram p5: board, inner layer Route2]
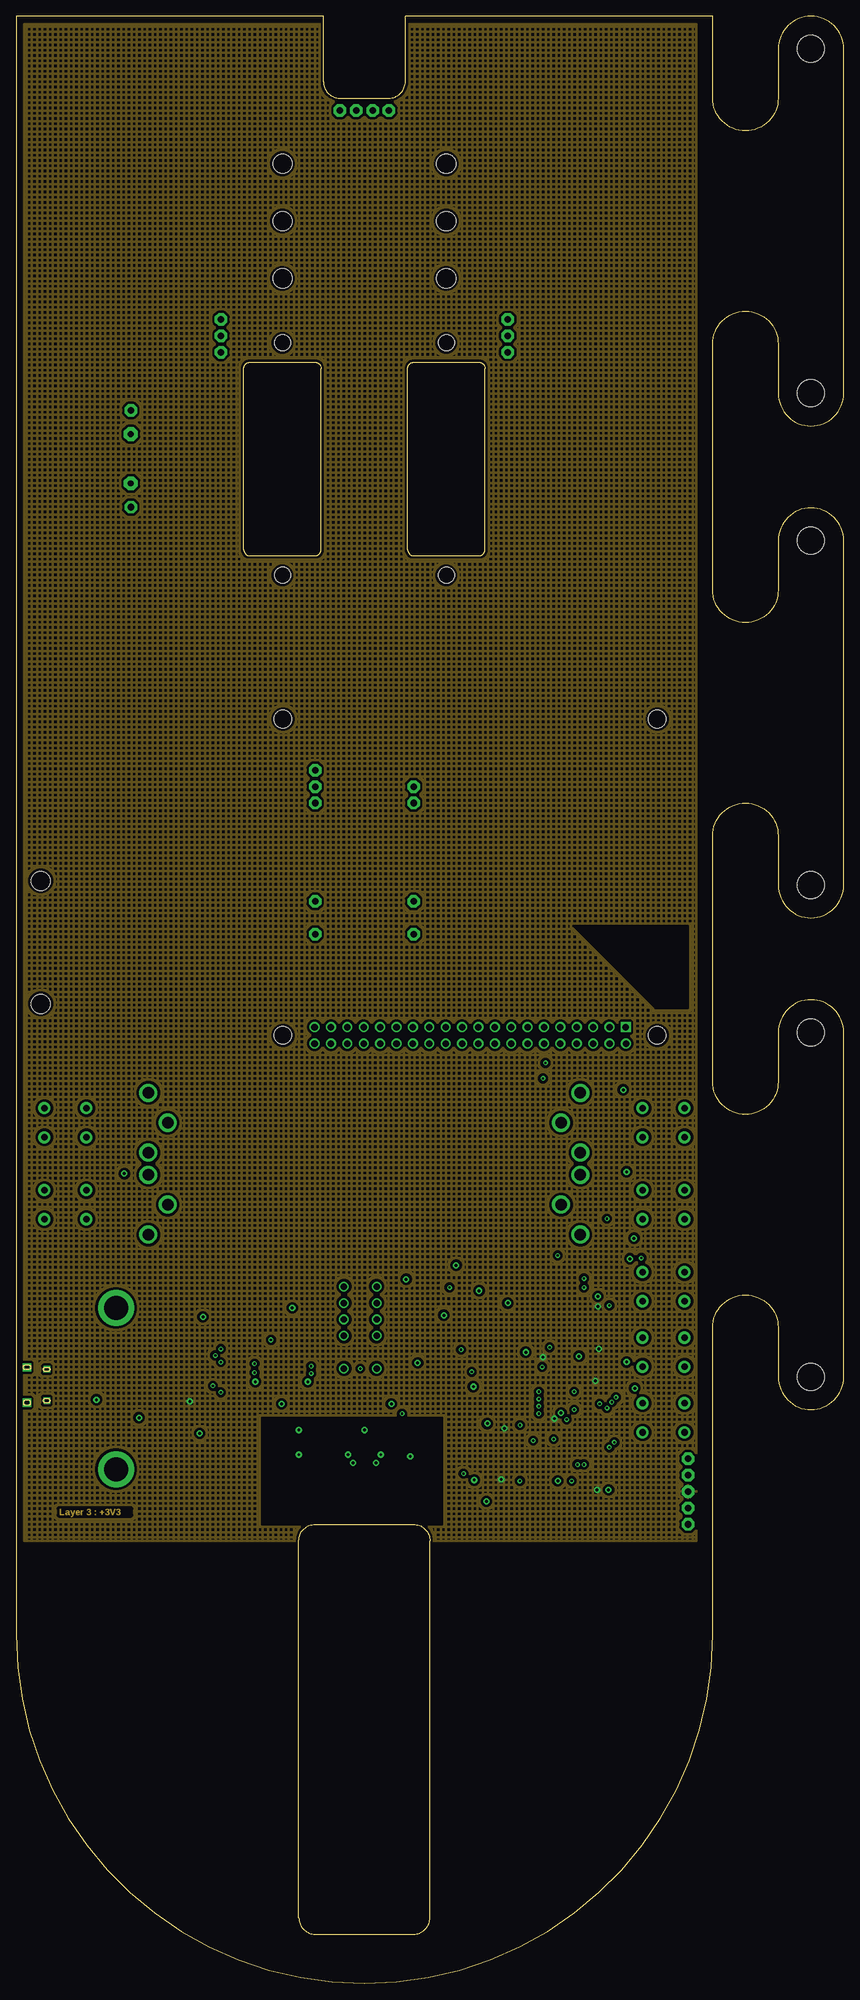
[diagram p6: board, inner layer Route3]
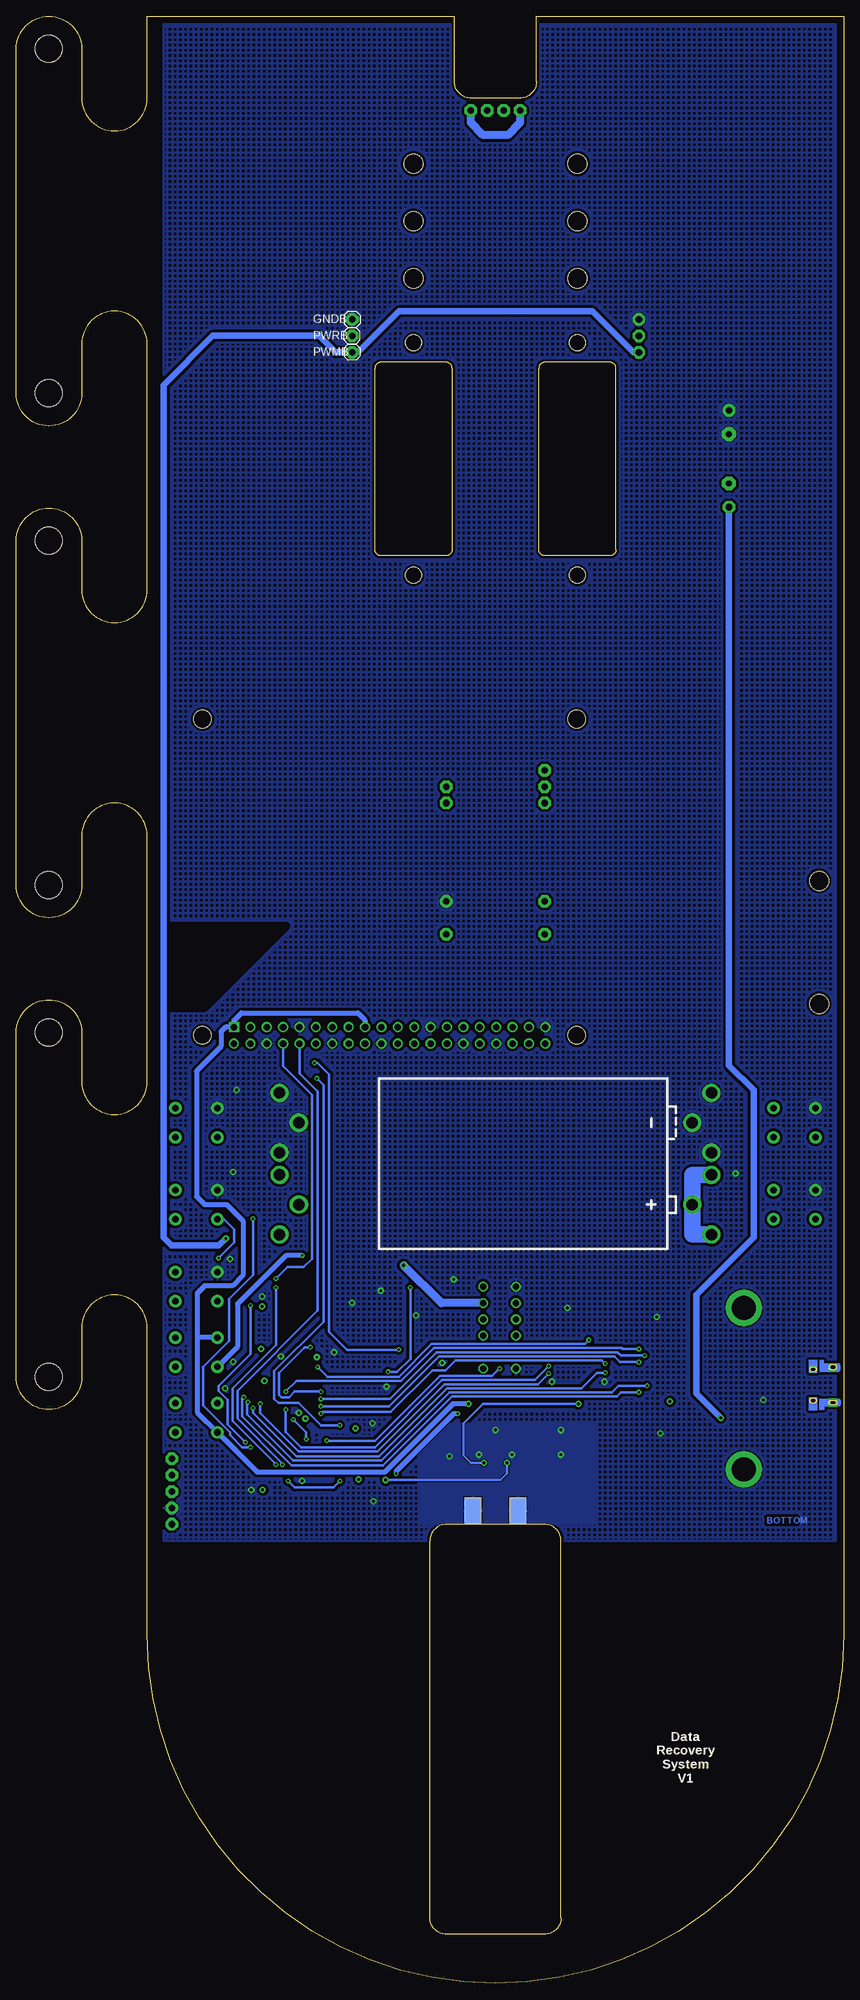
[diagram p7: board, bottom side, seen from below]

Size 128.27 x 304.8 mm. Coordinates in mm from the lower left corner, seen from the top.
Outline: 53.98,0 arc90 107.95,53.98 107.95,101.6 arc-180 118.11,101.6 118.11,93.98 arc180 128.27,93.98 128.27,147.32 arc180 118.11,147.32 118.11,139.7 arc-180 107.95,139.7 107.95,177.8 arc-180 118.11,177.8 118.11,170.18 arc180 128.27,170.18 128.27,223.52 arc180 118.11,223.52 118.11,215.9 arc-180 107.95,215.9 107.95,254 arc-180 118.11,254 118.11,246.38 arc180 128.27,246.38 128.27,299.72 arc180 118.11,299.72 118.11,292.1 arc-180 107.95,292.1 107.95,304.8 60.33,304.8 60.33,294.64 arc-90 57.78,292.1 50.16,292.1 arc-90 47.62,294.64 47.62,304.8 0,304.8 0,53.98 arc90 53.98,0
Outline: 35.27,222.18 35.27,250.18 arc-90 36.27,251.18 46.27,251.18 arc-90 47.27,250.18 47.27,222.18 arc-90 46.27,221.18 36.27,221.18 arc-90 35.27,222.18
Outline: 60.67,222.18 60.67,250.18 arc-90 61.67,251.18 71.67,251.18 arc-90 72.67,250.18 72.67,222.18 arc-90 71.67,221.18 61.67,221.18 arc-90 60.67,222.18
Outline: 43.81,10.16 43.81,68.58 arc-90 46.35,71.12 61.59,71.12 arc-90 64.14,68.58 64.14,10.16 arc-90 61.59,7.62 46.35,7.62 arc-90 43.81,10.16
Copper layers (1+2*3+16): Top 0.018mm / dielectric 0.36mm / Route2 0.035mm / dielectric 0.71mm / Route3 0.035mm / dielectric 0.36mm / Bottom 0.018mm
Design rules "Multi-CB_2L_125um-Tracks_OL35um *": minimum track width 0.125mm, minimum drill 0.2mm, track to track 0.125mm, track to pad 0.125mm, pad to pad 0.125mm, via to via 0.125mm, smd to smd 0mil, copper to edge 0.2mm, drill to drill 0.2mm, minimum pad ring 0.125mm, minimum via ring 0.125mm, stop-mask expansion 2mil, vias tented up to drill 0.45mm, thermal gap 0.2mm
Holes 2.5 mm at 41.27,218.18 41.27,254.18 66.67,218.18 66.67,254.18
Holes 3 mm at 41.27,281.94 41.27,273.05 41.27,264.16 66.67,281.94 66.67,273.05 66.67,264.16 3.81,151.76 3.81,170.81
Holes 4.2 mm at 123.19,170.18 123.19,223.52 123.19,299.72 123.19,246.38 123.19,93.98 123.19,147.32
tRestrict: area 86.4,151.1 to 104.1,163.8
bRestrict: area 86.4,151.1 to 104.1,163.8

### Footprints (pad centres in the part's own frame; a part is rotated, then mirrored left to right if it is on the bottom)
1X01 = drill 1.016 pad 1.93 octagon: 1 0,0
TACTILE-PTH = drill 1.016 pad 1.88: 1 -3.251,2.261; 2 3.251,2.261; 3 -3.251,-2.261; 4 3.251,-2.261
J502-ND-142-0711-821/826 = smd 4.191 x 1.778: 1 2.115,0 | smd 4.191 x 2.667: G@1 2.115,3.495; G@2 2.115,-3.495 | smd 4.191 x 2.667 bottom: G@3 2.115,3.495; G@4 2.115,-3.495
BATTERY-9V-KEYSTONE-593-594 = drill 1.778 pad 2.794: GND 0,-6.35; GND1 -2.997,-1.714; GND2 -2.997,-10.986; PWR 0,6.35; PWR1 -2.997,10.986; PWR2 -2.997,1.714
0603-NO@1 = smd 1.1 x 1: 1 -0.85,0; 2 0.85,0
0805-NO@1 = smd 1.3 x 1.5: 1 -0.95,0; 2 0.95,0
C0805 = smd 1.3 x 1.5: 1 -0.95,0; 2 0.95,0
C0603 = smd 1.1 x 1: 1 -0.85,0; 2 0.85,0
MICROBUILDER_FCI_10103594_CORRECTED = smd 1.425 x 2.5: BASE@1 -0.963,1.45; BASE@2 0.963,1.45 | smd 0.4 x 1.75: D+ 0,4.525; D- -0.65,4.525; GND 1.3,4.525; ID 0.65,4.525; VBUS -1.3,4.525 | drill 0.7 pad 1.25 square: SPRT@1 -2.736,1.679; SPRT@2 2.736,1.679 | drill 0.65 pad 1.016 square: SPRT@3 -2.426,4.747; SPRT@4 2.426,4.747
U.FL = smd 2.2 x 1.05: 1 0,1.375; 2 0,-1.375 | smd 0.8 x 1: 3 1.525,0
SOD-123 = smd 1.4 x 1.4: A 1.85,0; C -1.85,0
FIDUCIAL-1X2 = smd 1 x 1: 1 0,0
STANDOFF-ELECTRICAL-MCMASTER-95117A411 = drill 3.734 pad 5.588: P1 0,0
TQFP48-7X7 = smd 0.85 x 0.32: 1 -4.275,2.75; 2 -4.275,2.25; 3 -4.275,1.75; 4 -4.275,1.25; 5 -4.275,0.75; 6 -4.275,0.25; 7 -4.275,-0.25; 8 -4.275,-0.75; 9 -4.275,-1.25; 10 -4.275,-1.75; 11 -4.275,-2.25; 12 -4.275,-2.75; 25 4.275,-2.75; 26 4.275,-2.25; 27 4.275,-1.75; 28 4.275,-1.25; 29 4.275,-0.75; 30 4.275,-0.25; 31 4.275,0.25; 32 4.275,0.75; 33 4.275,1.25; 34 4.275,1.75; 35 4.275,2.25; 36 4.275,2.75 | smd 0.32 x 0.85: 13 -2.75,-4.275; 14 -2.25,-4.275; 15 -1.75,-4.275; 16 -1.25,-4.275; 17 -0.75,-4.275; 18 -0.25,-4.275; 19 0.25,-4.275; 20 0.75,-4.275; 21 1.25,-4.275; 22 1.75,-4.275; 23 2.25,-4.275; 24 2.75,-4.275; 37 2.75,4.275; 38 2.25,4.275; 39 1.75,4.275; 40 1.25,4.275; 41 0.75,4.275; 42 0.25,4.275; 43 -0.25,4.275; 44 -0.75,4.275; 45 -1.25,4.275; 46 -1.75,4.275; 47 -2.25,4.275; 48 -2.75,4.275 | smd 1 x 1: P$1 0,0
SOP65P400X130-8N = smd 1.321 x 0.356: 1 -1.829,0.965; 2 -1.829,0.33; 3 -1.829,-0.33; 4 -1.829,-0.965; 5 1.829,-0.965; 6 1.829,-0.33; 7 1.829,0.33; 8 1.829,0.965
SOT95P237X112-3N = smd 0.559 x 1.27: 1 -0.94,-1.041; 2 0.94,-1.041; 3 0,1.041
SOT23-5 = smd 0.55 x 1.2: 1 -0.95,-1.3; 2 0,-1.3; 3 0.95,-1.3; 4 0.95,1.3; 5 -0.95,1.3
SOT65P220X100-6N = smd 0.95 x 0.45: 1 -1.1,0.65; 2 -1.1,0; 3 -1.1,-0.65; 4 1.1,-0.65; 5 1.1,0; 6 1.1,0.65
MAX-M8 = smd 1.8 x 0.7: 1_GND 4.95,-4.4; 9_RESET_N 4.95,4.3; 10_GND -4.55,4.3; 18_SAFEBOOT_N -4.55,-4.4 | smd 1.8 x 0.8: 2_TXD 4.95,-3.35; 3_RXD 4.95,-2.25; 4_TIMEPULSE 4.95,-1.15; 5_EXTINT 4.95,-0.05; 6_V_BCKP 4.95,1.05; 7_VCC_IO 4.95,2.15; 8_VCC 4.95,3.25; 11_RF_IN -4.55,3.25; 12_GND -4.55,2.15; 13_LNA_EN -4.55,1.05; 14_VCC_RF -4.55,-0.05; 15_V_ANT/RESERVED -4.55,-1.15; 16_SDA -4.55,-2.25; 17_SCL -4.55,-3.35
QFN-20 = smd 0.7 x 0.25: 1 -1.45,1.55; 4 -1.45,-0.4; 5 -1.45,-1.25; 6 -1.45,-2.1; 7 1.45,-2.1; 8 1.45,-1.25; 9 1.45,-0.4; 12 1.45,1.55 | smd 1.1 x 0.25: 2 -1.25,0.9; 3 -1.25,0.25; 10 1.25,0.25; 11 1.25,0.9 | smd 0.25 x 0.7: 13 1.25,2.45; 14 0.75,2.45; 17 -0.75,2.45; 18 -1.25,2.45 | smd 0.25 x 1.1: 15 0.25,2.25; 16 -0.25,2.25 | smd 0.6 x 1.95: 19 -1,-1.25; 20 1,-1.25
SOT23-5' = smd 0.69 x 0.99: 1 -0.95,-1.29; 2 0,-1.29; 3 0.95,-1.29; 4 0.95,1.3; 5 -0.95,1.3
SS4-10-3.50-X-D = smd 0.23 x 0.93: 1 1.8,2.335; 2 1.8,-2.335; 3 1.4,2.335; 4 1.4,-2.335; 5 1,2.335; 6 1,-2.335; 7 0.6,2.335; 8 0.6,-2.335; 9 0.2,2.335; 10 0.2,-2.335; 11 -0.2,2.335; 12 -0.2,-2.335; 13 -0.6,2.335; 14 -0.6,-2.335; 15 -1,2.335; 16 -1,-2.335; 17 -1.4,2.335; 18 -1.4,-2.335; 19 -1.8,2.335; 20 -1.8,-2.335
WS2812B = smd 1.651 x 1: 1 -2.577,1.6; 2 -2.577,-1.6; 3 2.577,-1.6; 4 2.577,1.6
CHIPLED_0805_NOOUTLINE = smd 1.2 x 1.2: A 0,-1.05; C 0,1.05
RPI3 = drill 1.016 square: P$1 8.37,51.23 | drill 1.016: P$2 8.357,53.772; P$3 10.897,51.232; P$4 10.897,53.772; P$5 13.437,51.232; P$6 13.437,53.772; P$7 15.977,51.232; P$8 15.977,53.772; P$9 18.517,51.232; P$10 18.517,53.772; P$11 21.057,51.232; P$12 21.057,53.772; P$13 23.597,51.232; P$14 23.597,53.772; P$15 26.137,51.232; P$16 26.137,53.772; P$17 28.677,51.232; P$18 28.677,53.772; P$19 31.217,51.232; P$20 31.217,53.772; P$21 33.757,51.232; P$22 33.757,53.772; P$23 36.297,51.232; P$24 36.297,53.772; P$25 38.837,51.232; P$26 38.837,53.772; P$27 41.377,51.232; P$28 41.377,53.772; P$29 43.917,51.232; P$30 43.917,53.772; P$31 46.457,51.232; P$32 46.457,53.772; P$33 48.997,51.232; P$34 48.997,53.772; P$35 51.537,51.232; P$36 51.537,53.772; P$37 54.077,51.232; P$38 54.077,53.772; P$39 56.617,51.232; P$40 56.617,53.772 | hole 2.75: 3.5,3.5; 61.5,3.5; 3.5,52.5; 61.5,52.5
SOT23-WIDE = smd 1 x 1.2: 1 -0.95,-1; 2 0.95,-1; 3 0,1
SOT23-BEC = smd 1 x 1.4: B -0.95,-1.1; C 0,1.1; E 0.95,-1.1
0805-NO = smd 1.24 x 1.5: 1 -0.95,0; 2 0.95,0
R0805 = smd 1.3 x 1.5: 1 -0.95,0; 2 0.95,0
0603-NO = smd 1.1 x 1: 1 -0.85,0; 2 0.85,0
G6SK2DC5 = drill 1 pad 1.5: 1 -6.35,-2.54; 3 -1.27,-2.54; 4 1.27,-2.54; 5 3.81,-2.54; 6 6.35,-2.54; 7 6.35,2.54; 8 3.81,2.54; 9 1.27,2.54; 10 -1.27,2.54; 12 -6.35,2.54
F/QMB = drill 0.914 pad 2.159 octagon: + 3.81,0; - -3.81,0
XTAL3215 = smd 1.1 x 1.9: P$1 1.2,0; P$2 -1.2,0
CT/CN0603 = smd 1 x 1: 1 -1,0; 2 1,0

### Placement (x,y rotation side)
3V3  104.14,76.2 0 top
!RESET  100.33,107.95 0 top
ANTENNA  53.98,71.12 90 top
BAT1  84.45,127 180 top
BAT2  23.5,127 180 bottom
BUZ+  17.78,228.73 0 top
BUZ-  17.78,243.71 0 top
C1  100.2,141.22 0 top
C2  58.93,83.57 0 top
C3  49.4,83.57 180 top
C4  53.98,77.98 90 top
C5  74.8,88.27 180 top
C6  87.1,105.54 0 top
C7  92.75,102.39 270 top
C8  90.53,102.39 270 top
C9  82.2,79.86 270 top
C10  82.26,75.84 90 top
C11  74.4,102.87 90 top
C12  78.21,102.87 90 top
C13  73.03,93.6 180 top
C14  73.03,91.31 180 top
C15  69.19,109.22 0 top
C16  7.62,125.2 0 top
C17  7.62,137.9 0 top
C18  71.12,88.27 180 top
C19  91.89,81.69 0 top
C20  100.33,125.2 0 top
C21  100.33,137.9 0 top
C22  30.48,105.69 270 top
C23  27.3,105.69 270 top
C24  84.2,97.16 0 top
C25  92.71,92.84 0 top
C26  28.45,87.63 270 top
CLOSE_A  7.62,133.35 0 top
CLOSE_B  100.33,133.35 0 top
CON1  0,92.71 270 top
CON2  41.02,83.57 0 top
CTRL  46.35,187.96 270 top
D1  82.18,105.57 180 top
D2  53.34,91.44 180 top
D3  53.34,111.76 180 top
D4  81.41,110.87 0 top
D5  10.16,93.98 180 top
D6  25.4,111.76 180 top
D7  95.89,70.99 0 top
FD1  3.28,71.12 0 top
FD2  102.75,149.86 0 top
GND  104.14,73.66 270 top
GNDA  31.75,257.81 0 top
GNDB  76.2,257.81 0 bottom
H1  15.49,104.65 270 top
H2  15.49,79.66 270 top
IC1  83.82,90.17 0 top
IC2  94.49,140.34 0 top
IC3  91.66,96.91 0 top
IC4  86.72,102.39 270 top
IC5  53.98,82.42 270 top
IC6  67.94,80.39 0 top
IC7  69.32,104.14 0 top
IC8  74AHCT1G125DBV  [SOT23-5']  92.61,114.17 0 top
IC9  74AHCT1G125DBV  [SOT23-5']  90.55,109.35 180 top
J1  41.09,94.65 270 top
LED1  91.8,76.52 0 top
LED2  96.88,76.71 180 top
NC1  46.35,167.64 270 top
NC2  46.35,162.56 270 top
OFF  100.33,97.79 0 top
ON  100.33,87.63 0 top
OPEN_A  7.62,120.65 0 top
OPEN_B  100.33,120.65 0 top
PCB1  102.87,199.39 180 top
PWMA  31.75,252.73 0 top
PWMB  76.2,252.73 0 bottom
PWRA  31.75,255.27 0 top
PWRB  76.2,255.27 180 bottom
Q1  79.03,79.8 0 top
Q2  65.15,92.08 180 top
Q3  60.96,89.28 180 top
Q4  15.39,132.49 0 top
Q5  15.31,125.13 0 top
Q6  35.54,102.23 180 top
Q7  40.36,105.79 0 top
Q8  92.43,130.05 180 top
Q9  92.43,125.09 0 top
Q10  21.59,87.63 90 top
R1  79.15,76.62 180 top
R2  64.24,105.79 270 top
R3  71.9,97.76 180 top
R4  64.24,101.6 270 top
R5  60.96,92.2 180 top
R6  76.37,97.76 180 top
R7  39.48,101.73 90 top
R8  66.42,95.89 270 top
R9  64.26,95.89 270 top
R10  96.85,80.93 270 top
R11  64.24,109.98 270 top
R12  92.31,133.22 0 top
R13  93.45,120.9 90 top
R14  14.33,121.09 90 top
R15  15.45,129.35 180 top
R16  35.54,105.41 0 top
R17  16.3,121.09 90 top
R18  41.38,101.73 90 top
R19  91.55,120.9 90 top
R20  25.4,87.63 270 top
RELAY1  53.34,101.6 90 top
SG1  17.78,236.22 270 top
SWCLK  104.14,81.28 180 top
SWDIO  104.14,78.74 180 top
V+1  52.7,290.19 0 top
V+2  55.24,290.19 0 top
V-1  50.16,290.19 0 top
V-2  57.78,290.19 0 top
VBUS  104.14,71.12 0 top
VIN+1  61.59,182.88 270 top
VIN+2  61.59,185.42 270 top
VIN-1  46.35,185.42 270 top
VIN-2  46.35,182.88 270 top
VOUT+  61.59,162.56 270 top
VOUT-  61.59,167.64 270 top
X1  76.07,92.46 90 top
Z1  10.29,89.41 0 top
Z2  10.29,91.44 0 top

### Tracks (layer width: path | path; a pad name or v marks a point on that pad's centre or on a via)
3V3_PI  (via drill 0.45 pad 0.95)
  Top 0.813: R5.2 Q3.2 58.66,90.28 v58.17,89.79
  Bottom 0.813: PCB1.P$17 74.19,149.25 75.31,150.37 93.34,150.37 94.5,149.21 PCB1.P$1 95.81,148.16 96.52,147.45 96.52,145.16 100.33,141.35 100.33,121.92 99.06,120.65 95.63,120.65 93.09,118.11 93.09,109.73 94.74,108.08 99.06,108.08 100.2,106.93 100.2,99.95 | 100.2,99.95 100.2,88.49 ON.3 90.96,79.25 71.12,79.25 60.58,89.79 v58.17,89.79 | OFF.1 100.1,100.05 100.2,99.95
3V3SW  (via drill 0.45 pad 0.95)
  Top 0.406: Q1.3 82.19,80.8 C9.1 | IC5.4 52.88,81.32 v52.2,80.64 | v70.99,77.98 70.99,81.79 71.75,82.54 IC6.7_VCC_IO
  Top 0.61: Q1.3 76.43,80.8 74.69,82.54 IC6.7_VCC_IO IC6.8_VCC
  Bottom 0.406: v70.99,77.98 53.21,77.98 52.2,78.99 v52.2,80.64
5V_PI
  Top 1.27: 96.52,151.13 96.52,146.05 96.09,145.62 PCB1.P$2 PCB1.P$4
  Top 2.54: VOUT+.1 84.84,162.56 84.96,162.43 85.22,162.43 96.52,151.13
9603_PWR  (via drill 0.45 pad 0.95)
  Top 0.254: J1.2 39.35,92.86 39.88,92.33 | J1.1 42.82,92.86 42.29,92.33
  Top 0.406: IC5.6 55.08,81.32 v55.75,80.64 | v41.15,89.79 41.15,92.33
  Top 1.016: 39.88,92.33 40.77,92.33 | 40.77,92.33 41.15,92.33 42.29,92.33 | Q6.3 35.54,99.97 37.2,98.3 39.37,98.3 40.77,96.9 40.77,92.33
  Bottom 0.406: v55.75,80.64 57.78,80.64 58.93,81.79 58.93,86.74 55.88,89.79 v41.15,89.79
!RESET
  Top 0.305: IC1.40 85.07,95.23 85.71,95.87 IC3.1 88.82,95.87 88.82,98.22 90.04,99.44 94.23,99.44 95.25,100.46 95.25,104.65 96.29,105.69 !RESET.3
!SET_RELAY
  Top 0.813: R5.1 Q3.1 64.46,90.28 Q2.C
+3V3  (via drill 0.45 pad 0.95)
  Top 0.305: IC1.6 78.86,90.42 78.61,90.17 78.61,89.53 77.34,88.27 C5.1 | v81.66,97.03 81.66,96.52 83.07,95.11 IC1.44 | IC1.36 89.36,92.92 v89.79,93.34 | IC1.17 83.07,87.13 v83.44,87.5
  Top 0.406: IC4.5 C8.1 | C8.1 92.65,103.34 C7.1 | C5.1 75.75,86.04 v75.69,85.98 | LED1.1 89.22,77.28 v90.04,76.45 | v75.18,78.11 76.07,78.11 76.2,77.98 | C25.1 90.81,92.84 90.3,93.34 v89.79,93.34 | v90.3,98.3 90.64,97.95 IC3.3 | C8.1 90.53,104.54 v90.17,104.9 90.42,104.9 91.5,105.98 IC9.5
  Top 0.61: IC6.6_V_BCKP 74.26,81.44 76.2,79.5 76.2,77.98 76.2,75.56 76.83,74.93 80.14,74.93 | 80.14,74.93 82.22,74.93 C10.1 | Q1.2 79.98,76.75 | R1.1 80.1,74.96 80.14,74.93
  Top 0.813: C19.1 89.95,81.69 89.22,80.97 LED1.1 | 79.98,76.75 R1.1 | Q10.2 R20.1 27.05,88.58 | 27.05,88.58 C26.1 | v26.92,90.17 26.92,88.71 27.05,88.58
  pour Route3 (isolate 0.406, rank 2, hatched): 1.27,303.53 105.41,303.53 105.41,68.58 1.27,68.58
+5V
  Top 0.203: IC7.9 71.37,103.74 71.48,103.63 71.48,102.87 | 71.48,102.87 71.48,102.23 71.28,102.04 IC7.7 | 71.48,102.87 70.79,102.87 IC7.8 IC7.20
  Top 0.406: IC7.20 70.32,100.67 70.34,100.65
  Top 0.813: R4.2 70.34,100.65 74.4,100.65 | 74.4,100.65 78.21,100.65 | C11.1 74.4,100.65 | R15.1 16.3,131.46 Q4.2 | R12.1 91.48,133.2 Q8.2 91.04,131.05 89.92,129.92 89.92,115.32 | C12.1 78.21,100.65 | 78.21,100.65 80.58,100.65 82.17,102.23 82.17,107.82 83.44,109.09 85.85,109.09 89.92,113.16 89.92,115.32 | IC8.5 90.07,115.47 89.92,115.32 | Q6.2 34.59,105.31
  Top 1.016: R15.1 16.3,128.73 18.03,127 18.03,117.86 17.65,117.47 17.65,112.27 20.7,109.22 27.3,109.22 | R4.2 62.55,100.65 60.45,98.55 47.5,98.55 44.45,101.6 44.45,107.95 43.18,109.22 34.67,109.22 | 27.3,109.22 30.48,109.22 | 30.48,109.22 34.67,109.22 | C23.1 27.3,109.22 | C22.1 30.48,109.22 | 34.67,109.22 34.69,109.2 R16.1 34.59,105.31
A0  (via drill 0.35 pad 0.7)
  Top 0.305: IC1.3 80.8,91.92 v81.03,91.69
  Top 0.406: v96.9,112.39 94.36,109.86 94.36,100.71 93.73,100.08 84.2,100.08 v82.68,98.55
  Top 0.813: OPEN_B.3 99.34,118.39 101.28,120.33 C20.2
  Bottom 0.406: v81.03,91.69 85.09,91.69 85.98,90.81 87.12,90.81 87.5,91.19 87.5,94.61 83.57,98.55 v82.68,98.55 | OPEN_B.3 96.04,118.39 94.49,116.84 94.49,114.81 v96.9,112.39
A1  (via drill 0.35 pad 0.7)
  Top 0.305: v81.03,90.55 80.39,89.92 IC1.7
  Top 0.406: OPEN_A.3 4.37,105.11 12.19,97.28 v30.86,97.28
  Top 0.813: OPEN_A.3 6.63,118.39 8.57,120.33 C16.2
  Bottom 0.406: v30.86,97.28 34.54,97.28 35.05,97.79 63.12,97.79 70.36,90.55 v81.03,90.55
A2  (via drill 0.35 pad 0.7)
  Top 0.305: v81.03,89.41 81.01,89.42 IC1.8
  Top 0.406: CLOSE_A.3 2.54,129.26 2.54,105.03 11.3,96.27 v31.75,96.27
  Top 0.813: CLOSE_A.3 6.63,131.09 8.57,133.03 C17.2
  Bottom 0.406: v31.75,96.27 34.67,96.27 35.56,97.16 62.74,97.16 70.48,89.41 v81.03,89.41
A3  (via drill 0.35 pad 0.7)
  Top 0.254: J1.12 37.99,94.86 37.72,95.12 37.72,95.5 37.21,96.01 v36.96,96.01
  Top 0.305: v81.03,88.27 80.39,88.9 79.56,88.9 IC1.9
  Bottom 0.406: v36.96,96.01 37.47,96.52 60.2,96.52 61.72,95 63.75,95 70.23,88.52 80.77,88.52 v81.03,88.27
A4  (via drill 0.35 pad 0.7)
  Top 0.305: IC1.10 78.51,88.42 78.11,88.01 v78.11,86.49
  Top 0.406: CLOSE_B.3 94.74,133.43 94.74,136.02 94.11,136.65 91.44,136.65 90.17,137.92 90.17,139.7 89.66,140.21 v81.66,140.21
  Top 0.813: CLOSE_B.3 99.34,131.09 101.28,133.03 C21.2
  Bottom 0.406: v78.11,86.49 81.03,86.49 84.45,89.92 87.63,89.92 88.27,90.55 88.27,94.87 80.64,102.49 80.64,139.19 v81.66,140.21
A5  (via drill 0.35 pad 0.7)
  Top 0.305: v81.53,95.5 81.53,95.38 81.57,95.34 IC1.47
  Top 0.406: R18.1 R7.1 39.48,99.72 v39.5,99.69
  Bottom 0.406: v39.5,99.69 40.13,99.06 63.88,99.06 68.96,93.98 80.01,93.98 v81.53,95.5
ANTENNA
  Top 0.813: C4.1 ANTENNA.1
AREF
  Top 0.305: C18.1 71.97,89.11 73.03,90.17 77.34,90.17 77.6,90.42 77.6,91.06 77.96,91.42 IC1.4
D0
  Top 0.305: IC6.2_TXD 73.96,77.04 74.68,76.33 74.68,74.68 76.07,73.28 84.07,73.28 85.34,74.55 85.34,80.77 82.57,83.55 IC1.16
D1
  Top 0.305: IC1.15 82.07,83.28 84.84,80.52 84.84,74.8 83.82,73.79 76.45,73.79 75.31,74.93 75.31,76.83 74,78.14 IC6.3_RXD
D2  (via drill 0.35 pad 0.7)
  Top 0.305: IC1.23 86.07,85.13 88.14,83.06 v91.95,83.06
  Top 0.406: R13.1 R19.1 91.55,118.51 v91.57,118.49
  Bottom 0.406: v91.95,83.06 93.22,83.06 95.12,84.96 95.12,85.34 99.31,89.53 99.31,95.5 95.25,99.57 95.25,106.05 91.57,109.73 v91.57,118.49
D4  (via drill 0.35 pad 0.7)
  Top 0.305: IC1.13 81.07,85.01 v80.14,84.07
  Top 0.406: v53.34,95.25 53.34,89.79 51.05,87.5 34.92,87.5 31.37,83.95 26.67,83.95 25.4,85.22 R20.2
  Top 0.813: Q10.1 R20.2
  Bottom 0.406: v80.14,84.07 72.64,84.07 62.61,94.11 54.48,94.11 v53.34,95.25
D5  (via drill 0.35 pad 0.7)
  Top 0.305: IC1.24 90.64,85.89 v92.71,83.82
  Top 0.406: IC8.2 92.61,105.69 v91.95,105.03
  Bottom 0.406: v92.71,83.82 95.5,86.61 95.5,90.42 96.9,91.82 96.9,92.58 91.95,97.54 v91.95,105.03
D6  (via drill 0.35 pad 0.7)
  Top 0.254: J1.5 44.38,93.66 45.21,94.49 v45.72,94.49
  Top 0.305: v90.42,89.79 90.06,89.42 IC1.29
  Bottom 0.406: v45.72,94.49 47.37,92.84 61.85,92.84 72.26,82.42 84.45,82.42 90.42,88.39 v90.42,89.79
D7  (via drill 0.35 pad 0.7)
  Top 0.305: IC1.30 87.25,89.92 86.49,90.68 v86.49,91.69
  Top 0.406: R17.1 R14.1 14.33,112.54 20.57,106.3 20.57,100.71 22.99,98.3 v31.75,98.3
  Bottom 0.406: v31.75,98.3 34.29,98.3 34.42,98.42 63.5,98.42 68.58,93.34 84.84,93.34 v86.49,91.69
D8  (via drill 0.35 pad 0.7)
  Top 0.254: IC7.17 68.57,107.13 67.88,107.82 v67.18,107.82
  Top 0.305: IC1.11 80.36,87.92 80.77,87.5 81.53,87.5 81.79,87.76 81.79,91.95 78.99,94.74 v70.61,94.74
  Bottom 0.406: v70.61,94.74 69.22,94.74 67.18,96.77 v67.18,107.82
D9
  Top 0.305: IC1.12 80.1,86.87 81.79,86.87 82.27,87.35 82.27,92.1 77.98,96.39 76.07,96.39 75.42,97.05 R6.2
  Top 0.61: R6.2 R3.1
D10  (via drill 0.35 pad 0.7)
  Top 0.254: J1.6 37.92,93.66 37.72,93.85 37.72,94.36 37.47,94.61 v36.96,94.61
  Top 0.305: v91.57,89.15 90.83,88.42 IC1.27
  Bottom 0.406: v36.96,94.61 38.23,94.61 40.64,92.2 61.47,92.2 72.01,81.66 84.84,81.66 91.57,88.39 v91.57,89.15
D11  (via drill 0.35 pad 0.7)
  Top 0.305: IC1.25 85.39,87.42 v85.34,87.38
  Top 0.406: Q1.1 v78.08,77.85 78.08,76.75 R1.2 | v83.31,84.33 83.31,83.82 86.11,81.03 v86.11,77.85
  Bottom 0.406: v78.08,77.85 79.09,76.83 85.09,76.83 v86.11,77.85 | v85.34,87.38 83.31,85.34 v83.31,84.33
D12  (via drill 0.35 pad 0.7)
  Top 0.254: J1.7 44.14,94.06 v45.72,95.63
  Top 0.305: v86.49,88.9 86.61,88.9 86.63,88.92 IC1.28
  Bottom 0.406: v45.72,95.63 47.88,93.47 62.23,93.47 72.64,83.06 84.07,83.06 86.49,85.47 v86.49,88.9
D13
  Top 0.305: IC1.26 89.84,87.92 95.98,81.78
  Top 0.813: LED1.4 94.38,80.17 95.98,81.78 R10.1
D+  (via drill 0.35 pad 0.7)
  Top 0.305: IC1.34 89.82,91.92 90.55,91.19 92.58,91.19 v92.96,90.81
  Top 0.406: CON1.D+ 5.59,92.71 7.37,90.93 7.37,90.04 8,89.41 Z1.1 9.29,88.63 9.78,88.14 12.45,88.14 13.84,89.53 13.84,90.81 14.61,91.57 v31.75,91.57
  Bottom 0.406: v31.75,91.57 34.54,91.57 35.18,90.93 60.71,90.93 71.37,80.26 85.6,80.26 93.22,87.88 93.22,90.55 v92.96,90.81
D-  (via drill 0.35 pad 0.7)
  Top 0.305: IC1.33 89.43,91.42 90.3,90.55 91.82,90.55 v92.33,90.04
  Top 0.406: CON1.D- 6.21,93.36 6.99,92.58 9.27,92.58 | 9.27,92.58 v30.48,92.58 | Z2.1 9.29,92.57 9.27,92.58
  Bottom 0.406: v30.48,92.58 34.92,92.58 35.94,91.57 61.09,91.57 71.63,81.03 85.34,81.03 92.46,88.14 92.46,89.92 v92.33,90.04
GND  (via drill 0.45 pad 0.95)
  Top 0.203: IC7.14 IC7.13
  Top 0.254: v37.08,93.22 37.12,93.25 J1.4 39.53,93.25 39.75,93.47 39.75,94.11 | v45.21,93.22 45.17,93.25 J1.3 41.87,93.25 41.66,93.47 41.66,95.25 | 39.75,94.11 39.75,95.25 | 39.75,95.25 39.75,95.89 39.58,96.06 J1.18 | J1.14 39.75,95.25 | J1.8 39.7,94.06 39.75,94.11 | 41.66,95.25 41.66,95.5 41.81,95.66 J1.15 | J1.13 41.66,95.25 | IC7.14 70.07,109.15 C15.2 | v71.75,107.31 71.75,106.68 | 71.75,106.68 71.67,106.59 IC7.13 | IC7.12 71.53,105.69 71.75,105.92 71.75,106.68 | IC7.3 66.8,104.39 66.29,103.89 v66.29,103.5
  Top 0.305: C13.2 71.12,93.6 70.87,93.34 v70.87,92.46 70.87,91.57 71.12,91.31 C14.2 70.27,89.41 C18.2 70.27,87.46 70.99,86.74 v73.03,86.74 73.28,86.74 73.85,87.31 C5.2 73.85,89.09 74.42,89.66 77.85,89.66 78.11,89.92 78.11,90.68 78.35,90.92 IC1.5 | C25.2 93.91,92.58 95.5,92.58 v95.89,92.2 95.38,91.69 90.93,91.69 90.21,92.42 IC1.35 | IC1.42 84.07,95.5 85.05,96.48 C24.2 v87.25,97.16 | CON1.GND 4.75,91.19 CON1.SPRT@4 | CON1.BASE@2 1.45,90.2 CON1.SPRT@2 | CON1.BASE@1 1.45,95.22 CON1.SPRT@1 | Z2.2 11.43,91.44 v12.45,90.42 12.3,90.42 Z1.2 | IC1.18 83.57,86.49 84.45,87.38 v84.45,88.39
  Top 0.406: C7.2 90.63,101.54 | 90.63,101.54 C8.2 | IC4.2 86.72,102.39 | 86.72,102.39 88.85,102.39 89.7,101.54 90.63,101.54 | C6.2 88.05,105.09 86.72,103.76 86.72,102.39 | R17.2 16.26,121.98 Q5.E 16.26,124.97 v16.76,125.48 | R13.2 93.38,121.82 Q9.E 94.15,124 94.61,124.46 v94.61,125.73 | R2.1 62.91,106.74 61.7,107.95 61.7,109.09 | R11.1 64.18,110.87 62.72,110.87 61.7,109.86 61.7,109.09 | v95.12,112.27 94.17,112.27 IC8.3 93.56,113.86 93.24,114.17 91.97,114.17 91.66,113.86 IC8.1 91.66,111.85 91.5,111.69 | v60.45,109.09 61.7,109.09 | IC6.1_GND v72.9,74.68 | IC5.2 v53.98,85.72 | v61.09,81.66 61.12,81.66 62,82.54 IC6.12_GND 64.51,82.54 65.02,83.06 65.02,84.2 64.53,84.69 IC6.10_GND | IC3.2 94.22,95.87 v94.61,96.27 | IC2.4 93.67,139.37 94.11,138.94 v94.11,138.43 | 91.5,111.69 IC9.1 | IC9.3 89.6,111.32 89.98,111.69 91.5,111.69
  Top 0.61: v90.17,106.43 88.94,106.43 C6.2 | C9.2 83.52,78.91 83.95,78.49 v83.95,77.85 83.95,77.22 83.52,76.79 C10.2 | R6.1 77.35,97.79 v78.99,97.79 | C19.2 92.84,79.25 91.82,78.23 v91.82,76.45 91.82,75.56 92.47,74.92 LED1.3
  Top 0.813: LED2.C 96.88,75.18 96.62,74.93 LED1.3 | D3.A 51.49,108.64 RELAY1.7 | D2.A 51.49,94.56 RELAY1.12 | CLOSE_A.1 6.07,135.61 6.67,136.21 C17.1 | OPEN_A.1 6.07,122.91 6.67,123.51 C16.1 | CLOSE_B.1 98.78,135.61 99.38,136.21 C21.1 99.38,138.75 101.05,140.42 C1.2 | OPEN_B.1 98.78,122.91 99.38,123.51 C20.1 | R18.2 41.31,102.64 Q7.E 41.36,104.65 v42.8,104.65 | C11.2 74.4,104.88 74.93,105.41 v76.2,105.41 77.72,105.41 78.21,104.92 C12.2 | Q2.E 64.26,93.24 64.26,95 | 64.26,95 R9.2 | 64.26,95 63.37,95 v62.23,96.14 | C26.2 v28.45,85.22
  Top 1.016: C23.2 27.3,103.89 27.94,103.25 v28.96,103.25 29.84,103.25 30.48,103.89 C22.2
  Top 1.27: SG1.- BUZ-.1
  other vias: 43.81,85.72 43.81,81.92 51.44,81.92 56.52,81.92
  pour Top (isolate 0.102): 38.1,86.74 66.04,86.74 66.04,71.12 38.1,71.12
  pour Bottom (isolate 0.102): 38.1,86.74 66.04,86.74 66.04,71.12 38.1,71.12
  pour Route2 (isolate 0.406, rank 2, hatched): 105.41,68.58 105.41,303.53 1.27,303.53 1.27,68.58
  pour Top (isolate 0.406, rank 2, hatched): 105.41,68.58 105.41,303.53 1.27,303.53 1.27,68.58
  pour Bottom (isolate 0.406, rank 2, hatched): 105.41,68.58 105.41,303.53 1.27,303.53 1.27,69.85 1.27,68.58
GNSS
  Top 0.813: IC6.11_RF_IN 59.85,83.64 C2.2
GPIO2
  Top 0.406: IC2.5 95.33,139.37 94.87,139.83 94.87,141.99 93.47,143.38 91.31,143.38 90.68,144.02 90.68,146.86 PCB1.P$3
GPIO9
  Top 0.406: IC2.8 97.79,141.3 | 97.79,141.3 99.28,141.3 C1.1 | 97.79,141.3 97.79,138.56 96.77,137.54 91.82,137.54 91.06,138.3 91.06,140.08 90.04,141.1 73.15,141.1 70.48,143.76 70.48,146.94 69.27,148.16 PCB1.P$21
GPIO10
  Top 0.406: IC2.2 IC2.1 92.15,141.81 74.09,141.81 72.9,143 72.9,146.91 PCB1.P$19
IRIDIUM
  Top 0.813: CON2.3 C3.2
MOSI  (via drill 0.35 pad 0.7)
  Top 0.305: v87,80.39 87,81.03 84.07,83.95 IC1.19
  Bottom 0.406: PCB1.P$10 84.35,141 81.53,138.18 81.53,104.27 93.98,91.82 93.98,87.5 87,80.52 v87,80.39
N$1
  Top 0.305: IC1.1 78.4,92.92 77.67,93.66 X1.P$1 73.93,93.66 C13.1
N$2
  Top 0.305: IC1.2 77.94,92.42 76.78,91.26 X1.P$2 76.02,91.31 C14.1
N$3
  Top 0.813: R10.2 96.88,80.05 LED2.A
N$4
  Top 0.813: IC5.1 arc0 58.03,83.52 C2.1
N$5
  Top 1.27: V-1.1 50.16,288.29 52.07,286.38 | 48.26,182.88 VIN-2.1 VIN-1.1
  Top 2.54: 52.07,286.38 52.07,186.69 48.26,182.88
  Bottom 1.27: V-1.1 50.16,288.29 52.07,286.38 55.88,286.38 57.78,288.29 V-2.1
N$6
  Top 0.406: R4.1 R2.2 65.58,104.84 66.42,105.69 IC7.1
N$7
  Top 1.27: D6.C 45.72,111.76 46.99,110.49 46.99,104.14 48.26,102.87 RELAY1.9
N$8
  Top 0.813: IC5.3 arc0 50.3,83.52 C3.1
N$9
  Top 0.406: IC5.5 53.98,80.39
  Top 0.813: 53.98,80.39 C4.2
N$10
  Top 0.406: CON1.VBUS 8.28,94.01 D5.A
N$11
  Top 1.27: BAT2.PWR1 20.32,115.84 20.32,113.03 21.59,111.76 D6.A
  Bottom 2.54: BAT2.PWR2 23.5,125.28 BAT2.PWR 23.5,116.01 BAT2.PWR1
N$12
  Top 1.27: BAT1.PWR1 87.45,112.85 85.47,110.87 D4.A
  Top 2.54: BAT1.PWR2 84.45,125.28 BAT1.PWR 84.45,116.01 BAT1.PWR1
N$13
  Top 1.27: RELAY1.4 57.15,102.87 58.42,104.14 58.42,111.76 59.69,113.03 72.39,113.03 74.55,110.87 D4.C
N$14
  Top 0.813: Q2.B 66.42,93.5 R8.2
N$15
  Top 0.406: Q7.B 39.41,102.64 R7.2
N$16  (via drill 0.35 pad 0.7)
  Top 0.406: R8.1 67.53,96.73 v68.96,98.17 | IC2.3 93.65,140 93.98,140.34 93.98,141.6 92.96,142.62 v82.04,142.62
  Top 0.813: R9.1 R8.1
  Bottom 0.406: v68.96,98.17 76.96,98.17 79.76,100.97 79.76,140.84 81.53,142.62 v82.04,142.62
N$17
  Top 0.406: Q6.1 36.49,105.31 R16.2 36.39,106.36 36.96,106.93 40.32,106.93 Q7.C
N$18
  Top 0.406: Q9.B 91.48,121.81 R19.2
N$19
  Top 0.406: Q4.1 14.44,129.51 R15.2 14.6,126.94 Q5.C
N$20
  Top 0.406: Q5.B 14.36,121.98 R14.2
N$21
  Top 0.406: IC2.7 IC2.6
N$22
  Top 0.406: R12.2 93.38,133 Q8.1 92.38,130.05 91.42,130.05 91.04,129.67 91.04,126.75 91.59,126.19 Q9.C
N$23
  Top 0.813: VBUS.1 97.86,71.12 D7.A
N$24  (via drill 0.45 pad 0.95)
  Top 0.813: Q10.3 v19.05,87.63
  Top 1.27: SG1.+ BUZ+.1
  Bottom 1.016: v19.05,87.63 22.86,91.44 22.86,106.68 13.97,115.57 13.97,138.43 17.78,142.24 BUZ+.1
N$25
  cutout Route2: 38.1,71.12 38.1,87.63 66.04,87.63 66.04,71.12
N$26
  cutout Route3: 38.1,71.12 38.1,87.63 66.04,87.63 66.04,71.12
N$29
  Top 0.203: IC7.18 67,106.59
  Top 0.406: R11.2 65.19,109.03 66.14,108.08 66.14,107.44 67,106.59
PI_TX  (via drill 0.35 pad 0.7)
  Top 0.406: v88.01,109.22 90.17,109.22 90.55,109.6 IC9.2
  Bottom 0.406: PCB1.P$8 86.89,142.14 82.42,137.67 82.42,112.27 83.69,111 86.23,111 v88.01,109.22
PWM  (via drill 0.45 pad 0.95)
  Top 1.016: v95.76,115.44 95.73,115.47 IC8.4
  Bottom 1.016: PWMA.1 32.64,252.73 38.99,259.08 68.96,259.08 75.31,252.73 PWMB.1 78.74,252.73 81.28,255.27 97.79,255.27 105.41,247.65 105.41,115.57 104.14,114.3 96.9,114.3 v95.76,115.44
RESET_RELAY  (via drill 0.35 pad 0.7)
  Top 0.813: RELAY1.6 55.19,108.64 D3.C 58.24,114.81 73.28,114.81 75.31,112.78 v83.95,112.78
  Bottom 0.813: v83.95,112.78 86.46,112.78 93.98,105.26 93.98,98.63 OFF.3
RESTRICT
  cutout Route2: 104.14,163.83 104.14,151.13 99.06,151.13 86.36,163.83
  cutout Route3: 104.14,163.83 104.14,151.13 99.06,151.13 86.36,163.83
SCK  (via drill 0.35 pad 0.7)
  Top 0.305: v88.01,80.39 88.01,80.9 84.57,84.34 IC1.20
  Top 0.406: IC9.4 88.23,108.05 v88.01,107.82
  Bottom 0.406: v88.01,80.39 94.74,87.12 94.74,92.2 88.01,98.93 v88.01,107.82
SERVO_A_PWR
  Top 1.27: PWRA.1 19.05,255.27 15.39,251.61 Q4.3
SERVO_B_PWR
  Top 1.016: Q8.3 104.92,129.05 105.41,129.54 105.41,247.65 97.79,255.27 PWRB.1
SET_RELAY  (via drill 0.35 pad 0.7)
  Top 0.813: RELAY1.1 55.19,94.56 D2.C 55.19,89.46 56.37,88.28 v59.82,88.28 Q3.3 | ON.1 99.34,87.63 99.34,74.83 96.98,72.47 71.8,72.47 69.34,74.93 v69.34,78.99
  Bottom 0.813: v69.34,78.99 69.34,79.38 60.44,88.28 v59.82,88.28
SWCLK
  Top 0.305: 88.14,94.87 86.51,93.24 83.44,93.24 83.16,93.24 82.57,93.83 IC1.45
  Top 0.406: SWCLK.1 103.25,81.28 101.6,82.93 101.6,91.31 99.04,93.88 95.73,93.88 94.74,94.87 88.14,94.87
SWDIO
  Top 0.305: IC1.46 82.07,93.57 82.93,92.71 86.87,92.71 88.39,94.23
  Top 0.406: SWDIO.1 103.12,78.74 100.84,81.03 100.84,91.19 98.81,93.22 95.5,93.22 94.49,94.23 88.39,94.23
V_EXT
  Top 1.27: V+1.1 V+2.1 55.24,287.02 55.88,286.38 | 59.69,182.88 VIN+1.1 VIN+2.1
  Top 2.54: 59.69,182.88 55.88,186.69 55.88,286.38
VBAT  (via drill 0.45 pad 0.95)
  Top 0.305: IC7.16 69.07,107.71 68.24,108.54 C15.1
  Top 1.27: RELAY1.8 RELAY1.5 | C15.1 68.24,111.21 v68.2,111.25 71.37,111.25 73.79,108.84 79.5,108.84 80.33,108.01 D1.A
  Bottom 1.27: RELAY1.5 62.36,105.41 v68.2,111.25
VBUS
  Top 0.61: IC4.1 83.85,103.34 83.82,103.38 | IC4.3 83.98,101.44 83.82,101.6
  Top 0.813: D7.C 71.12,70.99 68.07,74.04 68.07,93.98 70.95,96.86 R3.2
  Top 1.016: D5.C 31.75,93.98 37.21,88.52 44.07,88.52 47.5,91.95 47.5,95.25 49.28,97.03 61.05,97.03 62.83,98.81 65.79,98.81 66.29,99.31 70.95,99.31 | C6.1 84.06,105.54 D1.C 83.82,105.36 83.82,103.38 83.82,101.6 81.53,99.31 70.95,99.31 | R3.2 70.95,99.31
VDDCORE2
  Top 0.305: IC1.43 83.57,96.94 C24.1

### Text on the board
Top: TOP
Route2: Layer 2 : GND
Route3: Layer 3 : +3V3
Bottom: BOTTOM
tPlace: Data / Recovery / System / V1
bPlace: Data / Recovery / System / V1
tNames: GND
tDocu: VSCORE data is in layer 148